# EAGLE design oresat-proto-card (EAGLE 9.3.0)

## Sheet 1 of 5: Connectors
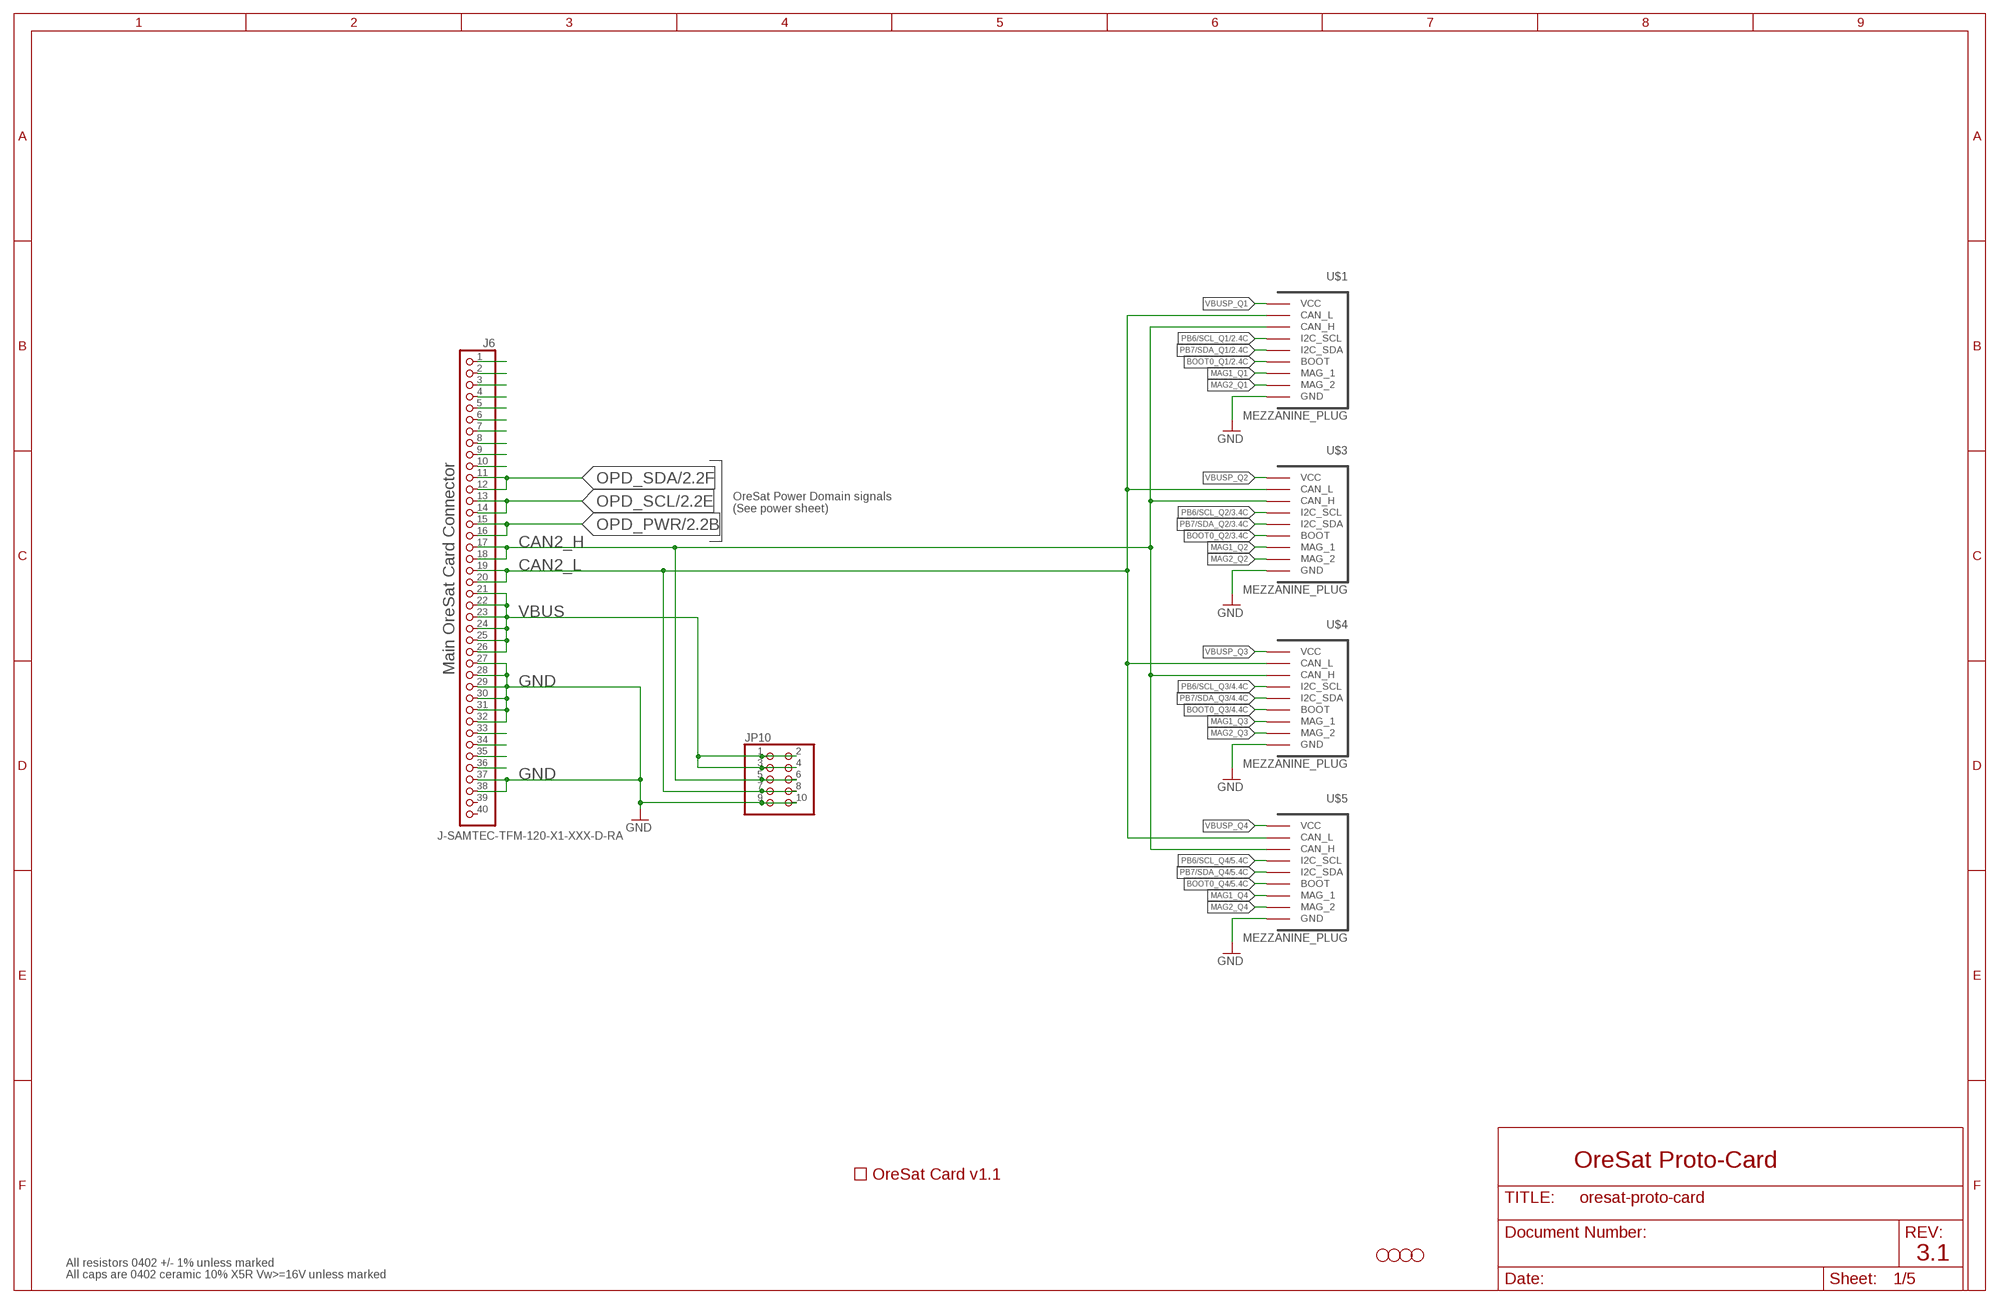
[diagram p0: schematic, sheet 1]

### Parts
H1  STAND-OFFTIGHT  [STAND-OFF-TIGHT]
H2  STAND-OFFTIGHT  [STAND-OFF-TIGHT]
H3  STAND-OFFTIGHT  [STAND-OFF-TIGHT]
H4  STAND-OFFTIGHT  [STAND-OFF-TIGHT]
J6  J-SAMTEC-TFM-120-X1-XXX-D-RA  [J-SAMTEC-TFM-120-X1-XXX-D-RA]
JP10  PINHD-2X5  [2X05]
U$1  MEZZANINE_PLUG  [MEZZANINE_PLUG]
U$2  ORESAT-CARD-V1.1-3XRF  [ORESAT-CARD-V1.1-3XRF]
U$3  MEZZANINE_PLUG  [MEZZANINE_PLUG]
U$4  MEZZANINE_PLUG  [MEZZANINE_PLUG]
U$5  MEZZANINE_PLUG  [MEZZANINE_PLUG]

### Nets
BOOT0_Q1: U$1.P$9(BOOT) U$1.P$22(BOOT) ; also sheet 2
BOOT0_Q2: U$3.P$9(BOOT) U$3.P$22(BOOT) ; also sheet 3
BOOT0_Q3: U$4.P$9(BOOT) U$4.P$22(BOOT) ; also sheet 4
BOOT0_Q4: U$5.P$9(BOOT) U$5.P$22(BOOT) ; also sheet 5
CAN2_H: J6.17 J6.18 JP10.5 JP10.6 U$1.P$6(CAN_H) U$1.P$25(CAN_H) U$3.P$6(CAN_H) U$3.P$25(CAN_H) U$4.P$6(CAN_H) U$4.P$25(CAN_H) U$5.P$6(CAN_H) U$5.P$25(CAN_H)
CAN2_L: J6.19 J6.20 JP10.7 JP10.8 U$1.P$5(CAN_L) U$1.P$26(CAN_L) U$3.P$5(CAN_L) U$3.P$26(CAN_L) U$4.P$5(CAN_L) U$4.P$26(CAN_L) U$5.P$5(CAN_L) U$5.P$26(CAN_L)
GND: J6.27 J6.28 J6.29 J6.30 J6.31 J6.32 J6.37 J6.38 JP10.9 JP10.10 U$1.P$1(GND) U$1.P$2(GND) U$1.P$14(GND) U$1.P$15(GND) U$1.P$16(GND) U$1.P$17(GND) U$1.P$29(GND) U$1.P$30(GND) U$3.P$1(GND) U$3.P$2(GND) U$3.P$14(GND) U$3.P$15(GND) U$3.P$16(GND) U$3.P$17(GND) U$3.P$29(GND) U$3.P$30(GND) U$4.P$1(GND) U$4.P$2(GND) U$4.P$14(GND) U$4.P$15(GND) U$4.P$16(GND) U$4.P$17(GND) U$4.P$29(GND) U$4.P$30(GND) U$5.P$1(GND) U$5.P$2(GND) U$5.P$14(GND) U$5.P$15(GND) U$5.P$16(GND) U$5.P$17(GND) U$5.P$29(GND) U$5.P$30(GND) ; also sheet 2,3,4,5
MAG1_Q1: U$1.P$10(MAG_1) U$1.P$21(MAG_1)
MAG1_Q2: U$3.P$10(MAG_1) U$3.P$21(MAG_1)
MAG1_Q3: U$4.P$10(MAG_1) U$4.P$21(MAG_1)
MAG1_Q4: U$5.P$10(MAG_1) U$5.P$21(MAG_1)
MAG2_Q1: U$1.P$11(MAG_2) U$1.P$20(MAG_2)
MAG2_Q2: U$3.P$11(MAG_2) U$3.P$20(MAG_2)
MAG2_Q3: U$4.P$11(MAG_2) U$4.P$20(MAG_2)
MAG2_Q4: U$5.P$11(MAG_2) U$5.P$20(MAG_2)
N$1: J6.34
N$271: J6.33
N$300: J6.2
N$400: J6.35
N$406: J6.36
N$479: J6.9
N$480: J6.4
N$482: J6.5
N$498: J6.1
N$499: J6.7
N$500: J6.6
N$503: J6.8
N$504: J6.10
OPD_PWR: J6.15 J6.16 ; also sheet 2,3,4,5
OPD_SCL: J6.13 J6.14 ; also sheet 2,3,4,5
OPD_SDA: J6.11 J6.12 ; also sheet 2,3,4,5
PB6/SCL_Q1: U$1.P$7(I2C_SCL) U$1.P$24(I2C_SCL) ; also sheet 2
PB6/SCL_Q2: U$3.P$7(I2C_SCL) U$3.P$24(I2C_SCL) ; also sheet 3
PB6/SCL_Q3: U$4.P$7(I2C_SCL) U$4.P$24(I2C_SCL) ; also sheet 4
PB6/SCL_Q4: U$5.P$7(I2C_SCL) U$5.P$24(I2C_SCL) ; also sheet 5
PB7/SDA_Q1: U$1.P$8(I2C_SDA) U$1.P$23(I2C_SDA) ; also sheet 2
PB7/SDA_Q2: U$3.P$8(I2C_SDA) U$3.P$23(I2C_SDA) ; also sheet 3
PB7/SDA_Q3: U$4.P$8(I2C_SDA) U$4.P$23(I2C_SDA) ; also sheet 4
PB7/SDA_Q4: U$5.P$8(I2C_SDA) U$5.P$23(I2C_SDA) ; also sheet 5
SPARE4: J6.3
VBUS: J6.21 J6.22 J6.23 J6.24 J6.25 J6.26 JP10.1 JP10.2 JP10.3 JP10.4 ; also sheet 2,3,4,5
VBUSP_Q1: U$1.P$3(VCC) U$1.P$4(VCC) U$1.P$12(VCC) U$1.P$13(VCC) U$1.P$18(VCC) U$1.P$19(VCC) U$1.P$27(VCC) U$1.P$28(VCC) ; also sheet 2
VBUSP_Q2: U$3.P$3(VCC) U$3.P$4(VCC) U$3.P$12(VCC) U$3.P$13(VCC) U$3.P$18(VCC) U$3.P$19(VCC) U$3.P$27(VCC) U$3.P$28(VCC) ; also sheet 3
VBUSP_Q3: U$4.P$3(VCC) U$4.P$4(VCC) U$4.P$12(VCC) U$4.P$13(VCC) U$4.P$18(VCC) U$4.P$19(VCC) U$4.P$27(VCC) U$4.P$28(VCC) ; also sheet 4
VBUSP_Q4: U$5.P$3(VCC) U$5.P$4(VCC) U$5.P$12(VCC) U$5.P$13(VCC) U$5.P$18(VCC) U$5.P$19(VCC) U$5.P$27(VCC) U$5.P$28(VCC) ; also sheet 5
Unconnected: J6.39 J6.40

### Notes on the sheet
- OreSat Power Domain signals
  (See power sheet)
- Main OreSat Card Connector
- OreSat Proto-Card
- 3.1
- All resistors 0402 +/- 1% unless marked
- All caps are 0402 ceramic 10% X5R Vw>=16V unless marked

## Sheet 2 of 5: Power Domaine Q1
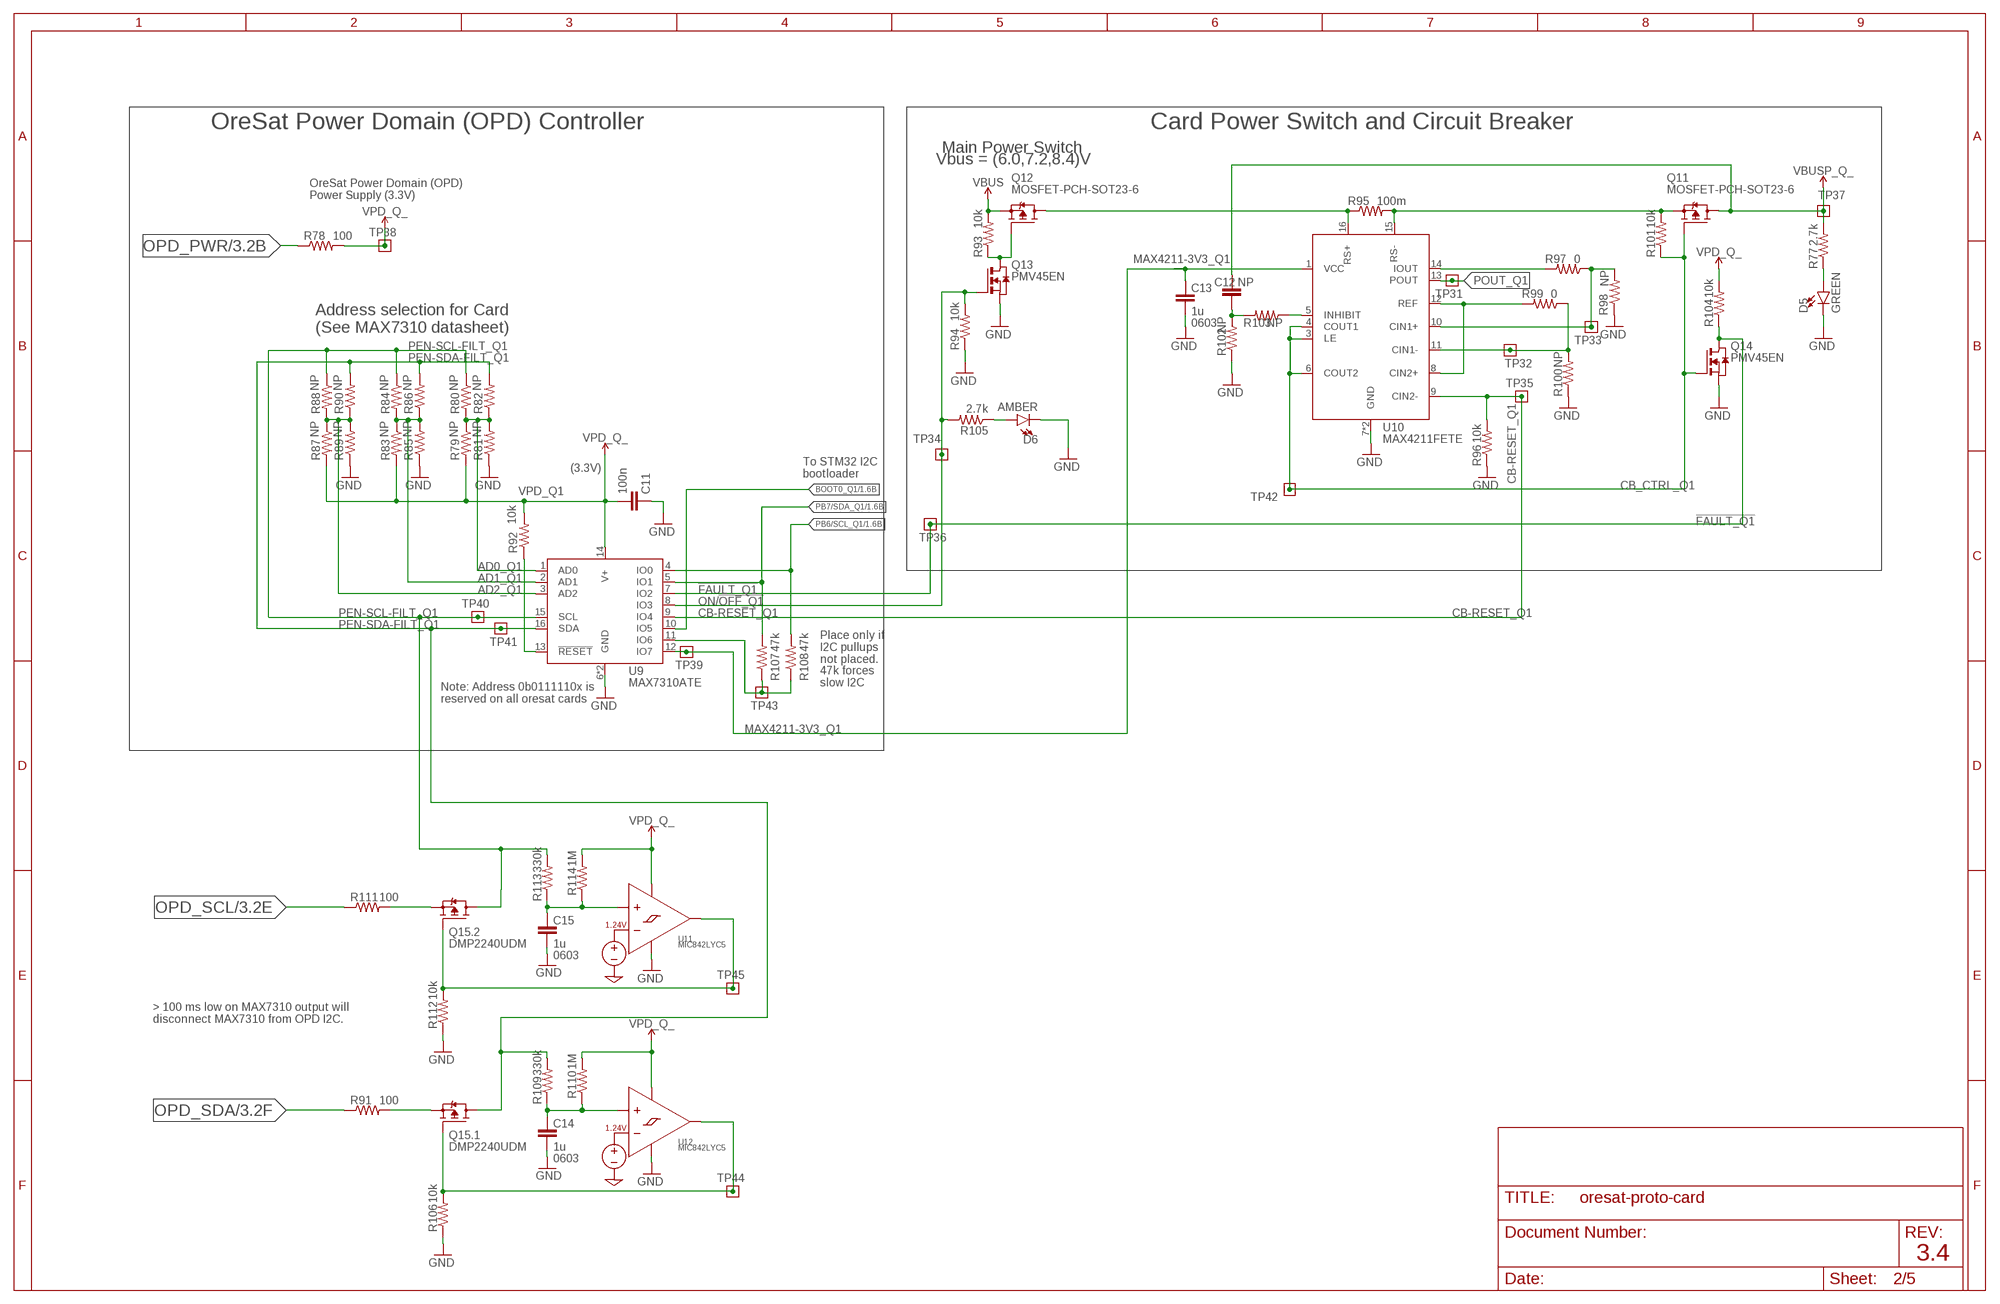
[diagram p1: schematic, sheet 2]

### Parts
C11  100n  C-EU0402-B-NOSILK  [.0402-B-NOSILK]
C12  NP  C-EU0402-B-NOSILK  [.0402-B-NOSILK]
C13  1u  C-EU0603-B-NOSILK  [.0603-B-NOSILK]
C14  1u  C-EU0603-B-NOSILK  [.0603-B-NOSILK]
C15  1u  C-EU0603-B-NOSILK  [.0603-B-NOSILK]
D5  GREEN  LED-GREEN0603  [LED-0603]
D6  AMBER  LED-GREEN0603  [LED-0603]
Q11  MOSFET-PCH-SOT23-6  [SOT23-6]
Q12  MOSFET-PCH-SOT23-6  [SOT23-6]
Q13  PMV45EN  [SOT23]
Q14  PMV45EN  [SOT23]
Q15  DMP2240UDM  MOSFET-PCH-SOT23-6  [SOT23-6]
R77  2.7k  R-US_0402-B-NOSILK  [.0402-B-NOSILK]
R78  100  R-US_0402-B-NOSILK  [.0402-B-NOSILK]
R79  NP  R-US_0402-B-NOSILK  [.0402-B-NOSILK]
R80  NP  R-US_0402-B-NOSILK  [.0402-B-NOSILK]
R81  NP  R-US_0402-B-NOSILK  [.0402-B-NOSILK]
R82  NP  R-US_0402-B-NOSILK  [.0402-B-NOSILK]
R83  NP  R-US_0402-B-NOSILK  [.0402-B-NOSILK]
R84  NP  R-US_0402-B-NOSILK  [.0402-B-NOSILK]
R85  NP  R-US_0402-B-NOSILK  [.0402-B-NOSILK]
R86  NP  R-US_0402-B-NOSILK  [.0402-B-NOSILK]
R87  NP  R-US_0402-B-NOSILK  [.0402-B-NOSILK]
R88  NP  R-US_0402-B-NOSILK  [.0402-B-NOSILK]
R89  NP  R-US_0402-B-NOSILK  [.0402-B-NOSILK]
R90  NP  R-US_0402-B-NOSILK  [.0402-B-NOSILK]
R91  100  R-US_0402-B-NOSILK  [.0402-B-NOSILK]
R92  10k  R-US_0402-B-NOSILK  [.0402-B-NOSILK]
R93  10k  R-US_0402-B-NOSILK  [.0402-B-NOSILK]
R94  10k  R-US_0402-B-NOSILK  [.0402-B-NOSILK]
R95  100m  R-US_R1206  [R1206]
R96  10k  R-US_0402-B-NOSILK  [.0402-B-NOSILK]
R97  0  R-US_0402-B-NOSILK  [.0402-B-NOSILK]
R98  NP  R-US_0402-B-NOSILK  [.0402-B-NOSILK]
R99  0  R-US_0402-B-NOSILK  [.0402-B-NOSILK]
R100  NP  R-US_0402-B-NOSILK  [.0402-B-NOSILK]
R101  10k  R-US_0402-B-NOSILK  [.0402-B-NOSILK]
R102  NP  R-US_0402-B-NOSILK  [.0402-B-NOSILK]
R103  NP  R-US_0402-B-NOSILK  [.0402-B-NOSILK]
R104  10k  R-US_0402-B-NOSILK  [.0402-B-NOSILK]
R105  2.7k  R-US_0402-B-NOSILK  [.0402-B-NOSILK]
R106  10k  R-US_0402-B-NOSILK  [.0402-B-NOSILK]
R107  47k  R-US_0402-B-NOSILK  [.0402-B-NOSILK]
R108  47k  R-US_0402-B-NOSILK  [.0402-B-NOSILK]
R109  330k  R-US_0402-B-NOSILK  [.0402-B-NOSILK]
R110  1M  R-US_0402-B-NOSILK  [.0402-B-NOSILK]
R111  100  R-US_0402-B-NOSILK  [.0402-B-NOSILK]
R112  10k  R-US_0402-B-NOSILK  [.0402-B-NOSILK]
R113  330k  R-US_0402-B-NOSILK  [.0402-B-NOSILK]
R114  1M  R-US_0402-B-NOSILK  [.0402-B-NOSILK]
TP31  TEST-POINT  [2MM-TEST-POINT]
TP32  TEST-POINT  [2MM-TEST-POINT]
TP33  TEST-POINT  [2MM-TEST-POINT]
TP34  TEST-POINT  [2MM-TEST-POINT]
TP35  TEST-POINT  [2MM-TEST-POINT]
TP36  TEST-POINT  [2MM-TEST-POINT]
TP37  TEST-POINT  [2MM-TEST-POINT]
TP38  TEST-POINT  [2MM-TEST-POINT]
TP39  TEST-POINT  [2MM-TEST-POINT]
TP40  TEST-POINT  [2MM-TEST-POINT]
TP41  TEST-POINT  [2MM-TEST-POINT]
TP42  TEST-POINT  [2MM-TEST-POINT]
TP43  TEST-POINT  [2MM-TEST-POINT]
TP44  TEST-POINT  [2MM-TEST-POINT]
TP45  TEST-POINT  [2MM-TEST-POINT]
U9  MAX7310ATE  MAX7310  [QFN65P400X400X80-17T210]
U10  MAX4211FETE  MAX4211  [QFN65P400X400X80-17T210]
U11  MIC842LYC5  [SC70-5]
U12  MIC842LYC5  [SC70-5]

### Nets
!FAULT_Q1: Q14.3(D) R104.1 TP36.1 U9.7(IO2)
AD0_Q1: R79.1 R80.2 R81.2 R82.1 U9.1(AD0)
AD1_Q1: R83.1 R84.2 R85.2 R86.1 U9.2(AD1)
AD2_Q1: R87.1 R88.2 R89.2 R90.1 U9.3(AD2)
BOOT0_Q1: U9.10(IO5) ; also sheet 1
CB-RESET_Q1: R96.2 TP35.1 U9.9(IO4) U10.9(CIN2-)
CB_CTRL_Q1: Q11.3(G) Q14.1(G) R101.1 TP42.1 U10.3(LE) U10.4(COUT1) U10.6(COUT2)
GND: C11.1 C13.2 C14.2 C15.2 D5.C D6.C Q13.2(S) Q14.2(S) R81.1 R85.1 R89.1 R94.1 R96.1 R98.1 R100.1 R102.1 R106.1 R112.1 U9.6(GND) U9.EPAD(GND) U10.7(GND) U10.EPAD(GND) U11.2(GND) U12.2(GND) ; also sheet 1,3,4,5
IOUT_Q1: R97.2 U10.14(IOUT)
MAX4211-3V3_Q1: C13.1 TP39.1 U9.12(IO7) U10.1(VCC)
N$169: D5.A R77.1
N$170: R92.1 U9.13(!RESET)
N$171: Q12.3(G) Q13.3(D) R93.1
N$172: Q12.1(D) Q12.2(D) Q12.5(D) Q12.6(D) R95.1 U10.16(RS+)
N$173: R97.1 R98.2 TP33.1 U10.10(CIN1+)
N$174: R99.1 R100.2 TP32.1 U10.11(CIN1-)
N$175: R99.2 U10.8(CIN2+) U10.12(REF)
N$176: R103.1 U10.5(INHIBIT)
N$177: C12.1 R102.2 R103.2
N$178: Q11.4(S) R95.2 R101.2 U10.15(RS-)
N$179: D6.A R105.1
N$180: Q15.5(.1:S) R91.2
N$181: Q15.1(.1:G) R106.2 TP44.1 U12.4(OUT)
N$182: R107.1 R108.1 TP43.1 U9.11(IO6)
N$183: Q15.2(.2:S) R111.2
N$184: Q15.3(.2:G) R112.2 TP45.1 U11.4(OUT)
N$185: C15.1 R113.1 R114.1 U11.1(INP)
N$186: C14.1 R109.1 R110.1 U12.1(INP)
ON/!OFF_Q1: Q13.1(G) R94.2 R105.2 TP34.1 U9.8(IO3)
OPD_PWR: R78.1 ; also sheet 1,3,4,5
OPD_SCL: R111.1 ; also sheet 1,3,4,5
OPD_SDA: R91.1 ; also sheet 1,3,4,5
PB6/SCL_Q1: R108.2 U9.4(IO0) ; also sheet 1
PB7/SDA_Q1: R107.2 U9.5(IO1) ; also sheet 1
PEN-SCL-FILT_Q1: Q15.4(.2:D) R80.1 R84.1 R88.1 R113.2 TP40.1 U9.15(SCL)
PEN-SDA-FILT_Q1: Q15.6(.1:D) R82.2 R86.2 R90.2 R109.2 TP41.1 U9.16(SDA)
POUT_Q1: TP31.1 U10.13(POUT)
VBUS: Q12.4(S) R93.2 ; also sheet 1,3,4,5
VBUSP_Q1: C12.2 Q11.1(D) Q11.2(D) Q11.5(D) Q11.6(D) R77.2 TP37.1 ; supply symbol labelled VBUSP_Q_ ; also sheet 1
VPD_Q1: C11.2 R78.2 R79.2 R83.2 R87.2 R92.2 R104.2 R110.2 R114.2 TP38.1 U9.14(V+) U11.5(VDD) U12.5(VDD) ; supply symbol labelled VPD_Q_

### Notes on the sheet
- OreSat Power Domain (OPD) Controller | Card Power Switch and Circuit Breaker
- Main Power Switch
- Vbus = (6.0,7.2,8.4)V
- OreSat Power Domain (OPD)
  Power Supply (3.3V)
- 0603
- Address selection for Card
  (See MAX7310 datasheet)
- (3.3V)
- To STM32 I2C
  bootloader
- Place only if
  I2C pullups
  not placed.
- 47k forces
  slow I2C
- Note: Address 0b0111110x is 
  reserved on all oresat cards
- 0603
- > 100 ms low on MAX7310 output will
  disconnect MAX7310 from OPD I2C.
- 0603
- 3.4

## Sheet 3 of 5: Power Domaine Q2
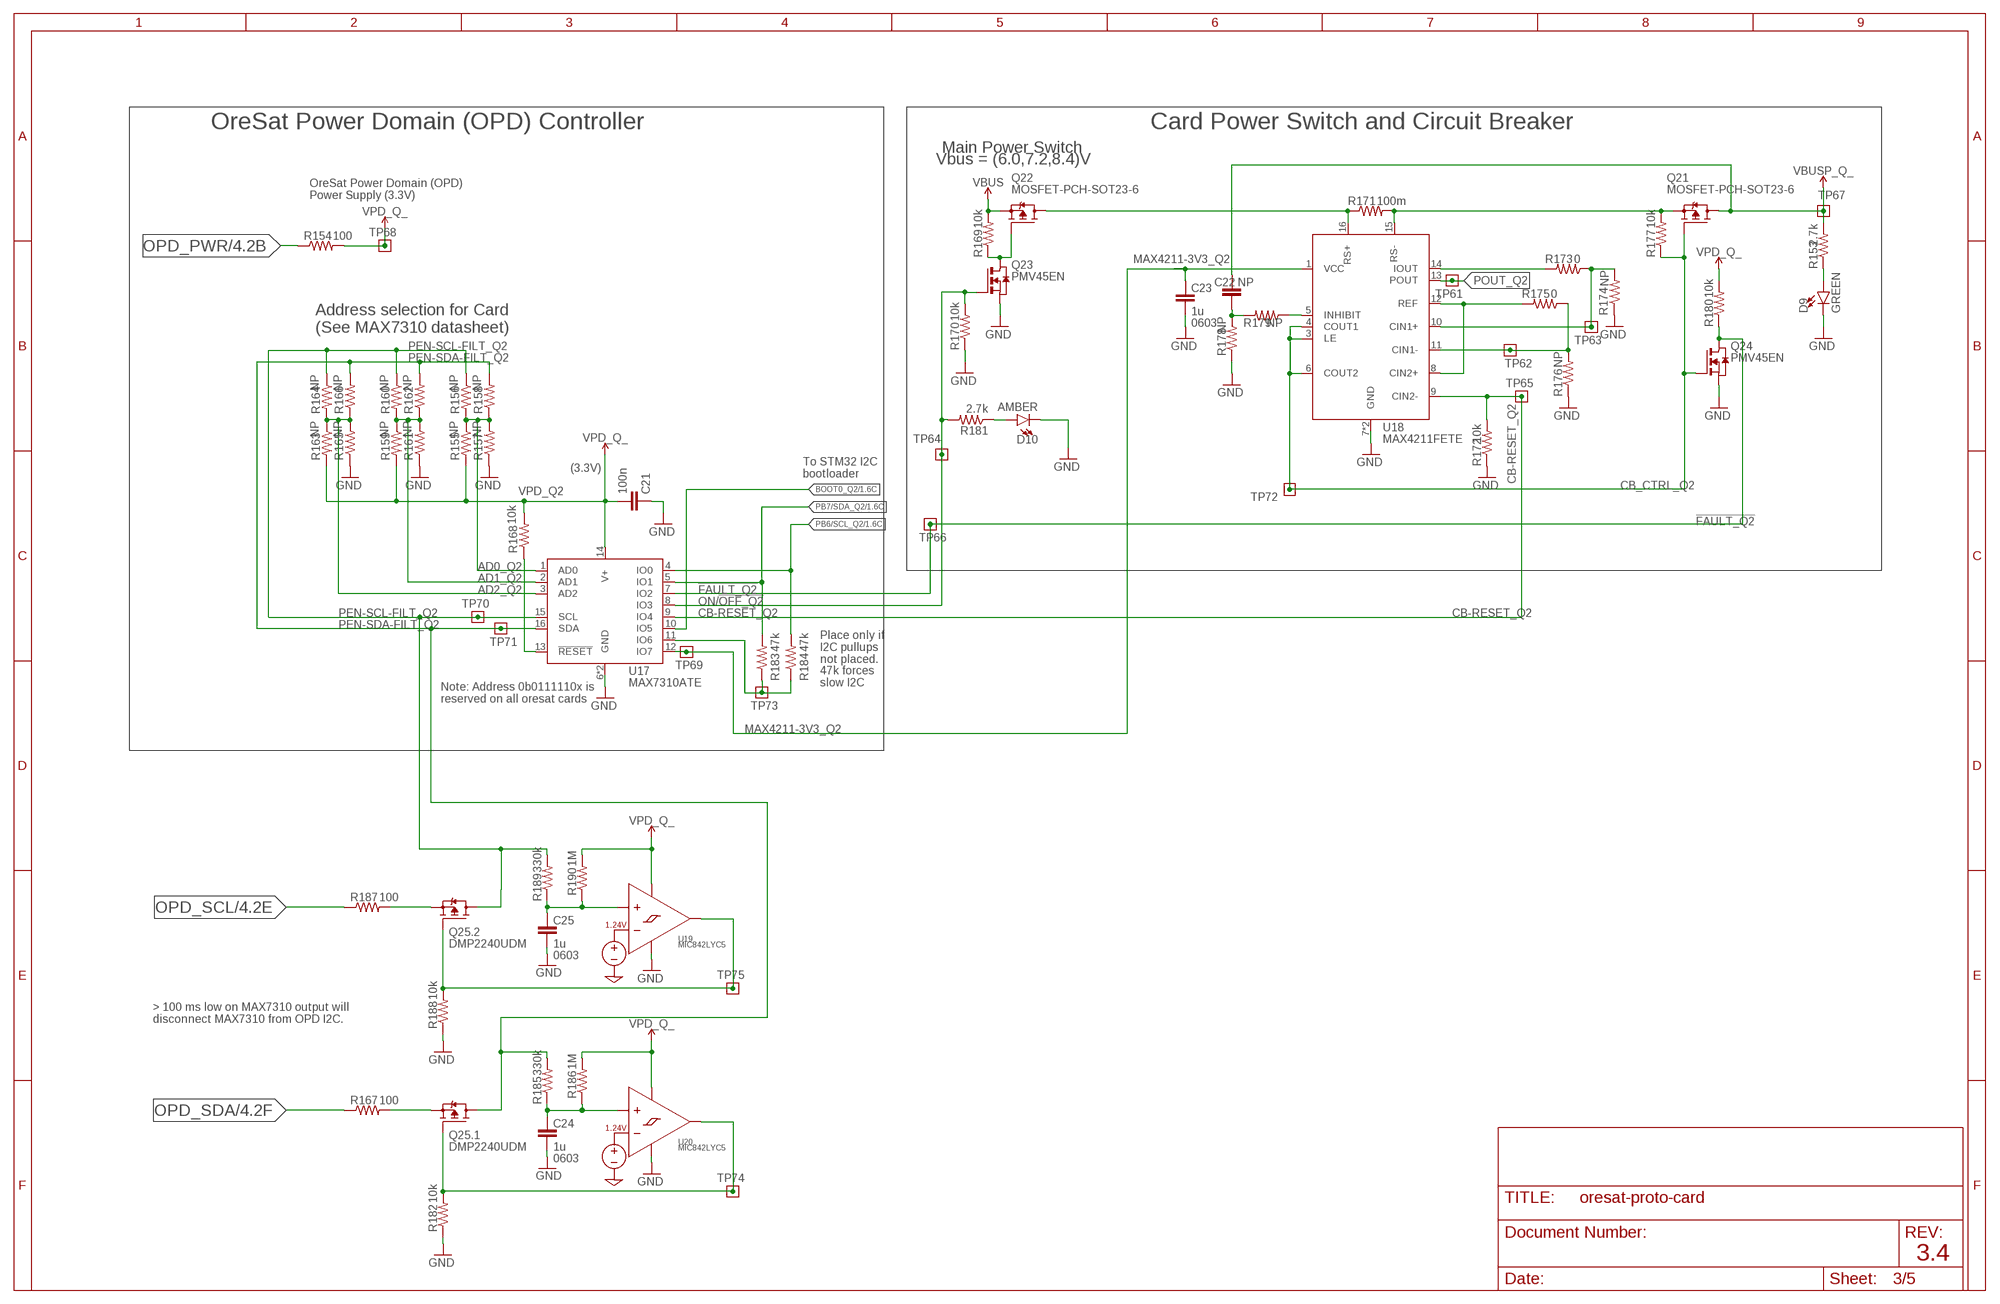
[diagram p2: schematic, sheet 3]

### Parts
C21  100n  C-EU0402-B-NOSILK  [.0402-B-NOSILK]
C22  NP  C-EU0402-B-NOSILK  [.0402-B-NOSILK]
C23  1u  C-EU0603-B-NOSILK  [.0603-B-NOSILK]
C24  1u  C-EU0603-B-NOSILK  [.0603-B-NOSILK]
C25  1u  C-EU0603-B-NOSILK  [.0603-B-NOSILK]
D9  GREEN  LED-GREEN0603  [LED-0603]
D10  AMBER  LED-GREEN0603  [LED-0603]
Q21  MOSFET-PCH-SOT23-6  [SOT23-6]
Q22  MOSFET-PCH-SOT23-6  [SOT23-6]
Q23  PMV45EN  [SOT23]
Q24  PMV45EN  [SOT23]
Q25  DMP2240UDM  MOSFET-PCH-SOT23-6  [SOT23-6]
R153  2.7k  R-US_0402-B-NOSILK  [.0402-B-NOSILK]
R154  100  R-US_0402-B-NOSILK  [.0402-B-NOSILK]
R155  NP  R-US_0402-B-NOSILK  [.0402-B-NOSILK]
R156  NP  R-US_0402-B-NOSILK  [.0402-B-NOSILK]
R157  NP  R-US_0402-B-NOSILK  [.0402-B-NOSILK]
R158  NP  R-US_0402-B-NOSILK  [.0402-B-NOSILK]
R159  NP  R-US_0402-B-NOSILK  [.0402-B-NOSILK]
R160  NP  R-US_0402-B-NOSILK  [.0402-B-NOSILK]
R161  NP  R-US_0402-B-NOSILK  [.0402-B-NOSILK]
R162  NP  R-US_0402-B-NOSILK  [.0402-B-NOSILK]
R163  NP  R-US_0402-B-NOSILK  [.0402-B-NOSILK]
R164  NP  R-US_0402-B-NOSILK  [.0402-B-NOSILK]
R165  NP  R-US_0402-B-NOSILK  [.0402-B-NOSILK]
R166  NP  R-US_0402-B-NOSILK  [.0402-B-NOSILK]
R167  100  R-US_0402-B-NOSILK  [.0402-B-NOSILK]
R168  10k  R-US_0402-B-NOSILK  [.0402-B-NOSILK]
R169  10k  R-US_0402-B-NOSILK  [.0402-B-NOSILK]
R170  10k  R-US_0402-B-NOSILK  [.0402-B-NOSILK]
R171  100m  R-US_R1206  [R1206]
R172  10k  R-US_0402-B-NOSILK  [.0402-B-NOSILK]
R173  0  R-US_0402-B-NOSILK  [.0402-B-NOSILK]
R174  NP  R-US_0402-B-NOSILK  [.0402-B-NOSILK]
R175  0  R-US_0402-B-NOSILK  [.0402-B-NOSILK]
R176  NP  R-US_0402-B-NOSILK  [.0402-B-NOSILK]
R177  10k  R-US_0402-B-NOSILK  [.0402-B-NOSILK]
R178  NP  R-US_0402-B-NOSILK  [.0402-B-NOSILK]
R179  NP  R-US_0402-B-NOSILK  [.0402-B-NOSILK]
R180  10k  R-US_0402-B-NOSILK  [.0402-B-NOSILK]
R181  2.7k  R-US_0402-B-NOSILK  [.0402-B-NOSILK]
R182  10k  R-US_0402-B-NOSILK  [.0402-B-NOSILK]
R183  47k  R-US_0402-B-NOSILK  [.0402-B-NOSILK]
R184  47k  R-US_0402-B-NOSILK  [.0402-B-NOSILK]
R185  330k  R-US_0402-B-NOSILK  [.0402-B-NOSILK]
R186  1M  R-US_0402-B-NOSILK  [.0402-B-NOSILK]
R187  100  R-US_0402-B-NOSILK  [.0402-B-NOSILK]
R188  10k  R-US_0402-B-NOSILK  [.0402-B-NOSILK]
R189  330k  R-US_0402-B-NOSILK  [.0402-B-NOSILK]
R190  1M  R-US_0402-B-NOSILK  [.0402-B-NOSILK]
TP61  TEST-POINT  [2MM-TEST-POINT]
TP62  TEST-POINT  [2MM-TEST-POINT]
TP63  TEST-POINT  [2MM-TEST-POINT]
TP64  TEST-POINT  [2MM-TEST-POINT]
TP65  TEST-POINT  [2MM-TEST-POINT]
TP66  TEST-POINT  [2MM-TEST-POINT]
TP67  TEST-POINT  [2MM-TEST-POINT]
TP68  TEST-POINT  [2MM-TEST-POINT]
TP69  TEST-POINT  [2MM-TEST-POINT]
TP70  TEST-POINT  [2MM-TEST-POINT]
TP71  TEST-POINT  [2MM-TEST-POINT]
TP72  TEST-POINT  [2MM-TEST-POINT]
TP73  TEST-POINT  [2MM-TEST-POINT]
TP74  TEST-POINT  [2MM-TEST-POINT]
TP75  TEST-POINT  [2MM-TEST-POINT]
U17  MAX7310ATE  MAX7310  [QFN65P400X400X80-17T210]
U18  MAX4211FETE  MAX4211  [QFN65P400X400X80-17T210]
U19  MIC842LYC5  [SC70-5]
U20  MIC842LYC5  [SC70-5]

### Nets
!FAULT_Q2: Q24.3(D) R180.1 TP66.1 U17.7(IO2)
AD0_Q2: R155.1 R156.2 R157.2 R158.1 U17.1(AD0)
AD1_Q2: R159.1 R160.2 R161.2 R162.1 U17.2(AD1)
AD2_Q2: R163.1 R164.2 R165.2 R166.1 U17.3(AD2)
BOOT0_Q2: U17.10(IO5) ; also sheet 1
CB-RESET_Q2: R172.2 TP65.1 U17.9(IO4) U18.9(CIN2-)
CB_CTRL_Q2: Q21.3(G) Q24.1(G) R177.1 TP72.1 U18.3(LE) U18.4(COUT1) U18.6(COUT2)
GND: C21.1 C23.2 C24.2 C25.2 D9.C D10.C Q23.2(S) Q24.2(S) R157.1 R161.1 R165.1 R170.1 R172.1 R174.1 R176.1 R178.1 R182.1 R188.1 U17.6(GND) U17.EPAD(GND) U18.7(GND) U18.EPAD(GND) U19.2(GND) U20.2(GND) ; also sheet 1,2,4,5
IOUT_Q2: R173.2 U18.14(IOUT)
MAX4211-3V3_Q2: C23.1 TP69.1 U17.12(IO7) U18.1(VCC)
N$205: D9.A R153.1
N$206: R168.1 U17.13(!RESET)
N$207: Q22.3(G) Q23.3(D) R169.1
N$208: Q22.1(D) Q22.2(D) Q22.5(D) Q22.6(D) R171.1 U18.16(RS+)
N$209: R173.1 R174.2 TP63.1 U18.10(CIN1+)
N$210: R175.1 R176.2 TP62.1 U18.11(CIN1-)
N$211: R175.2 U18.8(CIN2+) U18.12(REF)
N$212: R179.1 U18.5(INHIBIT)
N$213: C22.1 R178.2 R179.2
N$214: Q21.4(S) R171.2 R177.2 U18.15(RS-)
N$215: D10.A R181.1
N$216: Q25.5(.1:S) R167.2
N$217: Q25.1(.1:G) R182.2 TP74.1 U20.4(OUT)
N$218: R183.1 R184.1 TP73.1 U17.11(IO6)
N$219: Q25.2(.2:S) R187.2
N$220: Q25.3(.2:G) R188.2 TP75.1 U19.4(OUT)
N$221: C25.1 R189.1 R190.1 U19.1(INP)
N$222: C24.1 R185.1 R186.1 U20.1(INP)
ON/!OFF_Q2: Q23.1(G) R170.2 R181.2 TP64.1 U17.8(IO3)
OPD_PWR: R154.1 ; also sheet 1,2,4,5
OPD_SCL: R187.1 ; also sheet 1,2,4,5
OPD_SDA: R167.1 ; also sheet 1,2,4,5
PB6/SCL_Q2: R184.2 U17.4(IO0) ; also sheet 1
PB7/SDA_Q2: R183.2 U17.5(IO1) ; also sheet 1
PEN-SCL-FILT_Q2: Q25.4(.2:D) R156.1 R160.1 R164.1 R189.2 TP70.1 U17.15(SCL)
PEN-SDA-FILT_Q2: Q25.6(.1:D) R158.2 R162.2 R166.2 R185.2 TP71.1 U17.16(SDA)
POUT_Q2: TP61.1 U18.13(POUT)
VBUS: Q22.4(S) R169.2 ; also sheet 1,2,4,5
VBUSP_Q2: C22.2 Q21.1(D) Q21.2(D) Q21.5(D) Q21.6(D) R153.2 TP67.1 ; supply symbol labelled VBUSP_Q_ ; also sheet 1
VPD_Q2: C21.2 R154.2 R155.2 R159.2 R163.2 R168.2 R180.2 R186.2 R190.2 TP68.1 U17.14(V+) U19.5(VDD) U20.5(VDD) ; supply symbol labelled VPD_Q_

### Notes on the sheet
- OreSat Power Domain (OPD) Controller | Card Power Switch and Circuit Breaker
- Main Power Switch
- Vbus = (6.0,7.2,8.4)V
- OreSat Power Domain (OPD)
  Power Supply (3.3V)
- 0603
- Address selection for Card
  (See MAX7310 datasheet)
- (3.3V)
- To STM32 I2C
  bootloader
- Place only if
  I2C pullups
  not placed.
- 47k forces
  slow I2C
- Note: Address 0b0111110x is 
  reserved on all oresat cards
- 0603
- > 100 ms low on MAX7310 output will
  disconnect MAX7310 from OPD I2C.
- 0603
- 3.4

## Sheet 4 of 5: Power Domaine Q3
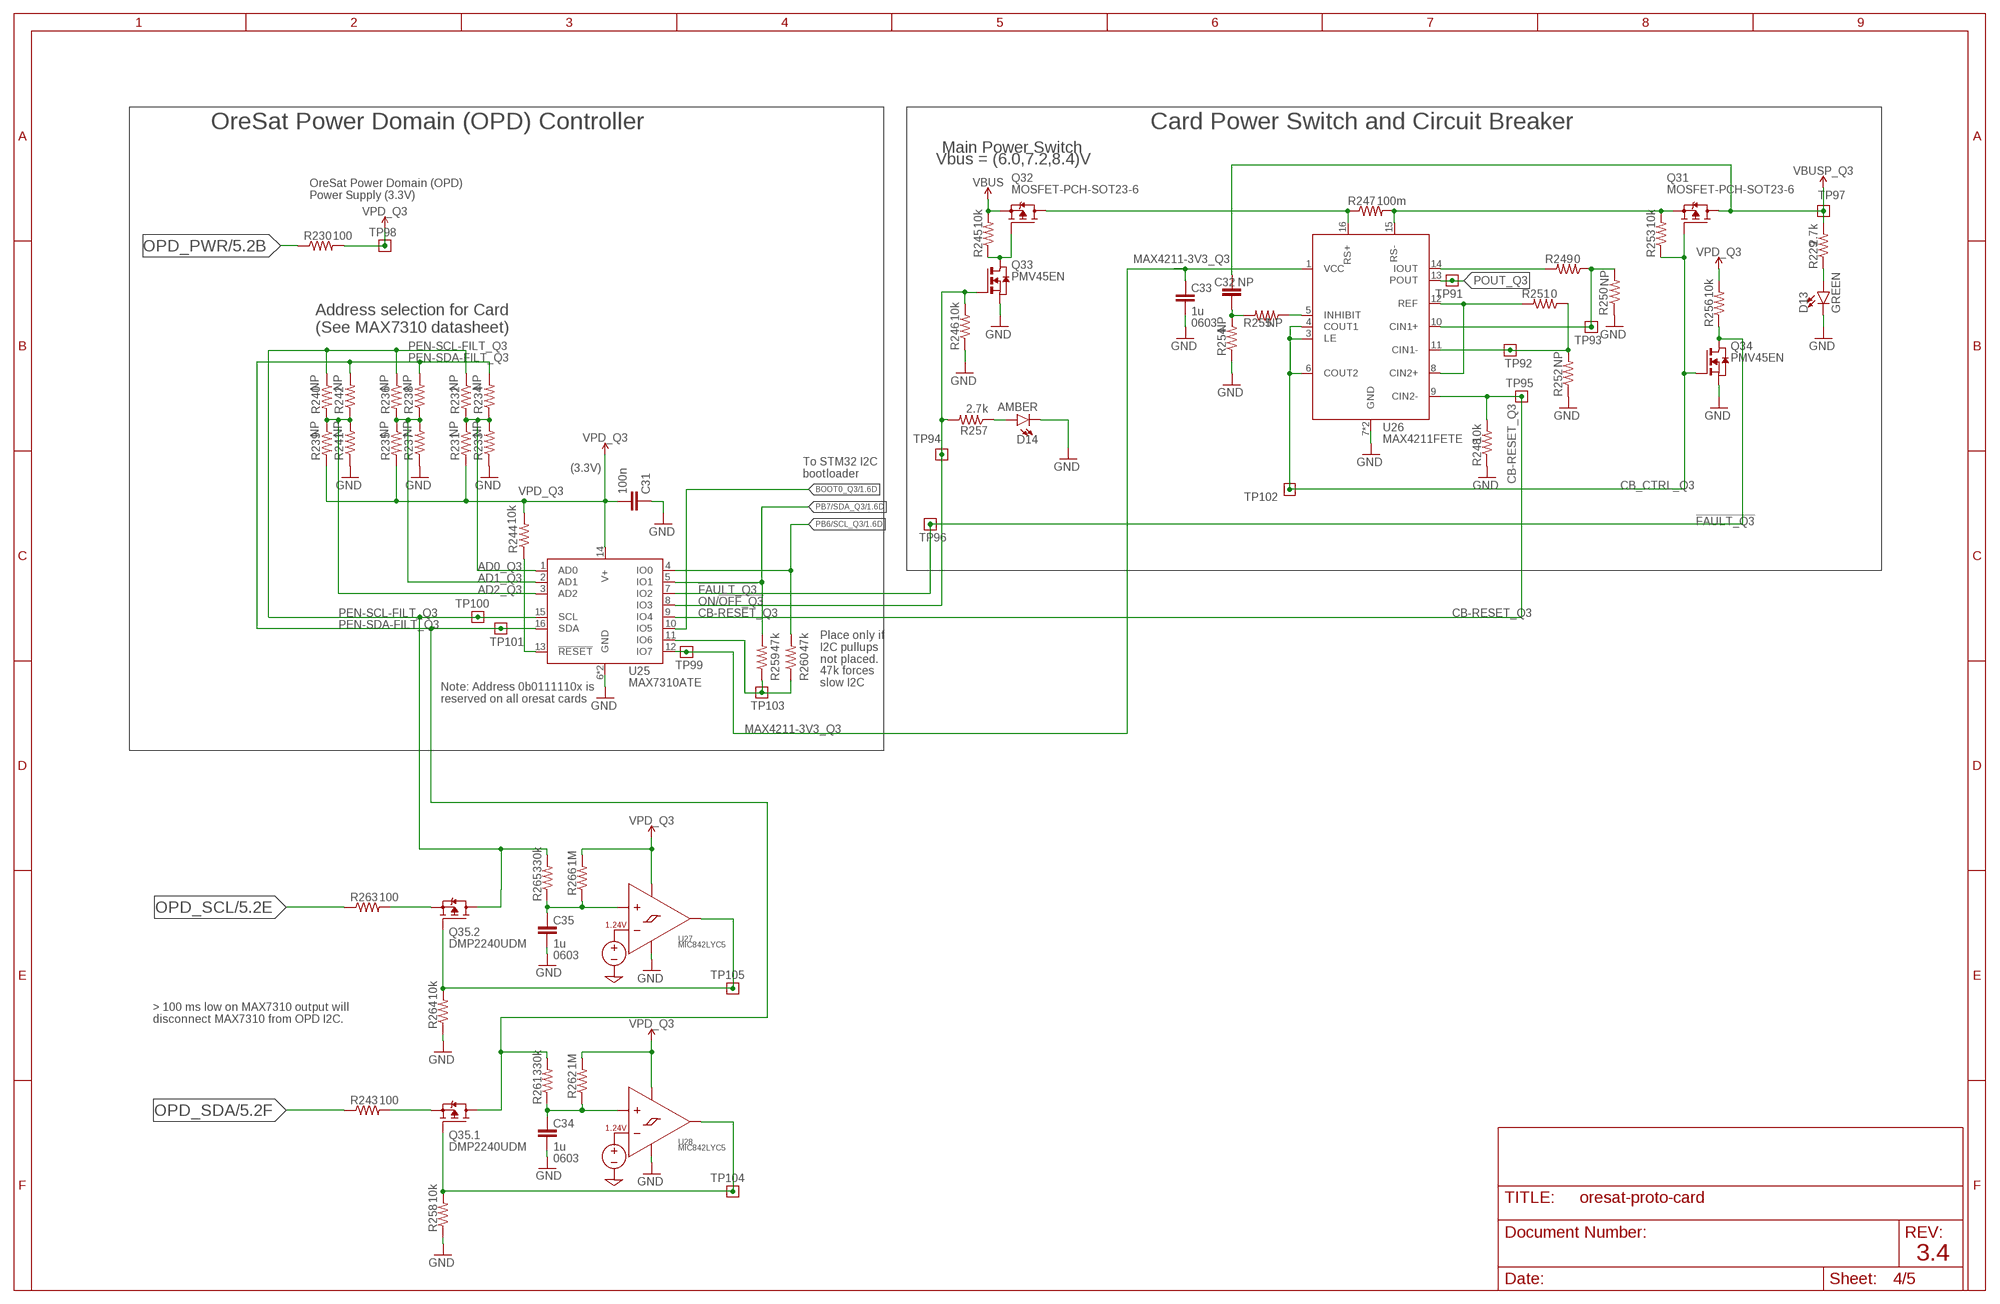
[diagram p3: schematic, sheet 4]

### Parts
C31  100n  C-EU0402-B-NOSILK  [.0402-B-NOSILK]
C32  NP  C-EU0402-B-NOSILK  [.0402-B-NOSILK]
C33  1u  C-EU0603-B-NOSILK  [.0603-B-NOSILK]
C34  1u  C-EU0603-B-NOSILK  [.0603-B-NOSILK]
C35  1u  C-EU0603-B-NOSILK  [.0603-B-NOSILK]
D13  GREEN  LED-GREEN0603  [LED-0603]
D14  AMBER  LED-GREEN0603  [LED-0603]
Q31  MOSFET-PCH-SOT23-6  [SOT23-6]
Q32  MOSFET-PCH-SOT23-6  [SOT23-6]
Q33  PMV45EN  [SOT23]
Q34  PMV45EN  [SOT23]
Q35  DMP2240UDM  MOSFET-PCH-SOT23-6  [SOT23-6]
R229  2.7k  R-US_0402-B-NOSILK  [.0402-B-NOSILK]
R230  100  R-US_0402-B-NOSILK  [.0402-B-NOSILK]
R231  NP  R-US_0402-B-NOSILK  [.0402-B-NOSILK]
R232  NP  R-US_0402-B-NOSILK  [.0402-B-NOSILK]
R233  NP  R-US_0402-B-NOSILK  [.0402-B-NOSILK]
R234  NP  R-US_0402-B-NOSILK  [.0402-B-NOSILK]
R235  NP  R-US_0402-B-NOSILK  [.0402-B-NOSILK]
R236  NP  R-US_0402-B-NOSILK  [.0402-B-NOSILK]
R237  NP  R-US_0402-B-NOSILK  [.0402-B-NOSILK]
R238  NP  R-US_0402-B-NOSILK  [.0402-B-NOSILK]
R239  NP  R-US_0402-B-NOSILK  [.0402-B-NOSILK]
R240  NP  R-US_0402-B-NOSILK  [.0402-B-NOSILK]
R241  NP  R-US_0402-B-NOSILK  [.0402-B-NOSILK]
R242  NP  R-US_0402-B-NOSILK  [.0402-B-NOSILK]
R243  100  R-US_0402-B-NOSILK  [.0402-B-NOSILK]
R244  10k  R-US_0402-B-NOSILK  [.0402-B-NOSILK]
R245  10k  R-US_0402-B-NOSILK  [.0402-B-NOSILK]
R246  10k  R-US_0402-B-NOSILK  [.0402-B-NOSILK]
R247  100m  R-US_R1206  [R1206]
R248  10k  R-US_0402-B-NOSILK  [.0402-B-NOSILK]
R249  0  R-US_0402-B-NOSILK  [.0402-B-NOSILK]
R250  NP  R-US_0402-B-NOSILK  [.0402-B-NOSILK]
R251  0  R-US_0402-B-NOSILK  [.0402-B-NOSILK]
R252  NP  R-US_0402-B-NOSILK  [.0402-B-NOSILK]
R253  10k  R-US_0402-B-NOSILK  [.0402-B-NOSILK]
R254  NP  R-US_0402-B-NOSILK  [.0402-B-NOSILK]
R255  NP  R-US_0402-B-NOSILK  [.0402-B-NOSILK]
R256  10k  R-US_0402-B-NOSILK  [.0402-B-NOSILK]
R257  2.7k  R-US_0402-B-NOSILK  [.0402-B-NOSILK]
R258  10k  R-US_0402-B-NOSILK  [.0402-B-NOSILK]
R259  47k  R-US_0402-B-NOSILK  [.0402-B-NOSILK]
R260  47k  R-US_0402-B-NOSILK  [.0402-B-NOSILK]
R261  330k  R-US_0402-B-NOSILK  [.0402-B-NOSILK]
R262  1M  R-US_0402-B-NOSILK  [.0402-B-NOSILK]
R263  100  R-US_0402-B-NOSILK  [.0402-B-NOSILK]
R264  10k  R-US_0402-B-NOSILK  [.0402-B-NOSILK]
R265  330k  R-US_0402-B-NOSILK  [.0402-B-NOSILK]
R266  1M  R-US_0402-B-NOSILK  [.0402-B-NOSILK]
TP91  TEST-POINT  [2MM-TEST-POINT]
TP92  TEST-POINT  [2MM-TEST-POINT]
TP93  TEST-POINT  [2MM-TEST-POINT]
TP94  TEST-POINT  [2MM-TEST-POINT]
TP95  TEST-POINT  [2MM-TEST-POINT]
TP96  TEST-POINT  [2MM-TEST-POINT]
TP97  TEST-POINT  [2MM-TEST-POINT]
TP98  TEST-POINT  [2MM-TEST-POINT]
TP99  TEST-POINT  [2MM-TEST-POINT]
TP100  TEST-POINT  [2MM-TEST-POINT]
TP101  TEST-POINT  [2MM-TEST-POINT]
TP102  TEST-POINT  [2MM-TEST-POINT]
TP103  TEST-POINT  [2MM-TEST-POINT]
TP104  TEST-POINT  [2MM-TEST-POINT]
TP105  TEST-POINT  [2MM-TEST-POINT]
U25  MAX7310ATE  MAX7310  [QFN65P400X400X80-17T210]
U26  MAX4211FETE  MAX4211  [QFN65P400X400X80-17T210]
U27  MIC842LYC5  [SC70-5]
U28  MIC842LYC5  [SC70-5]

### Nets
!FAULT_Q3: Q34.3(D) R256.1 TP96.1 U25.7(IO2)
AD0_Q3: R231.1 R232.2 R233.2 R234.1 U25.1(AD0)
AD1_Q3: R235.1 R236.2 R237.2 R238.1 U25.2(AD1)
AD2_Q3: R239.1 R240.2 R241.2 R242.1 U25.3(AD2)
BOOT0_Q3: U25.10(IO5) ; also sheet 1
CB-RESET_Q3: R248.2 TP95.1 U25.9(IO4) U26.9(CIN2-)
CB_CTRL_Q3: Q31.3(G) Q34.1(G) R253.1 TP102.1 U26.3(LE) U26.4(COUT1) U26.6(COUT2)
GND: C31.1 C33.2 C34.2 C35.2 D13.C D14.C Q33.2(S) Q34.2(S) R233.1 R237.1 R241.1 R246.1 R248.1 R250.1 R252.1 R254.1 R258.1 R264.1 U25.6(GND) U25.EPAD(GND) U26.7(GND) U26.EPAD(GND) U27.2(GND) U28.2(GND) ; also sheet 1,2,3,5
IOUT_Q_3: R249.2 U26.14(IOUT)
MAX4211-3V3_Q3: C33.1 TP99.1 U25.12(IO7) U26.1(VCC)
N$241: D13.A R229.1
N$242: R244.1 U25.13(!RESET)
N$243: Q32.3(G) Q33.3(D) R245.1
N$244: Q32.1(D) Q32.2(D) Q32.5(D) Q32.6(D) R247.1 U26.16(RS+)
N$245: R249.1 R250.2 TP93.1 U26.10(CIN1+)
N$246: R251.1 R252.2 TP92.1 U26.11(CIN1-)
N$247: R251.2 U26.8(CIN2+) U26.12(REF)
N$248: R255.1 U26.5(INHIBIT)
N$249: C32.1 R254.2 R255.2
N$250: Q31.4(S) R247.2 R253.2 U26.15(RS-)
N$251: D14.A R257.1
N$252: Q35.5(.1:S) R243.2
N$253: Q35.1(.1:G) R258.2 TP104.1 U28.4(OUT)
N$254: R259.1 R260.1 TP103.1 U25.11(IO6)
N$255: Q35.2(.2:S) R263.2
N$256: Q35.3(.2:G) R264.2 TP105.1 U27.4(OUT)
N$257: C35.1 R265.1 R266.1 U27.1(INP)
N$258: C34.1 R261.1 R262.1 U28.1(INP)
ON/!OFF_Q3: Q33.1(G) R246.2 R257.2 TP94.1 U25.8(IO3)
OPD_PWR: R230.1 ; also sheet 1,2,3,5
OPD_SCL: R263.1 ; also sheet 1,2,3,5
OPD_SDA: R243.1 ; also sheet 1,2,3,5
PB6/SCL_Q3: R260.2 U25.4(IO0) ; also sheet 1
PB7/SDA_Q3: R259.2 U25.5(IO1) ; also sheet 1
PEN-SCL-FILT_Q3: Q35.4(.2:D) R232.1 R236.1 R240.1 R265.2 TP100.1 U25.15(SCL)
PEN-SDA-FILT_Q3: Q35.6(.1:D) R234.2 R238.2 R242.2 R261.2 TP101.1 U25.16(SDA)
POUT_Q3: TP91.1 U26.13(POUT)
VBUS: Q32.4(S) R245.2 ; also sheet 1,2,3,5
VBUSP_Q3: C32.2 Q31.1(D) Q31.2(D) Q31.5(D) Q31.6(D) R229.2 TP97.1 ; also sheet 1
VPD_Q3: C31.2 R230.2 R231.2 R235.2 R239.2 R244.2 R256.2 R262.2 R266.2 TP98.1 U25.14(V+) U27.5(VDD) U28.5(VDD)

### Notes on the sheet
- OreSat Power Domain (OPD) Controller | Card Power Switch and Circuit Breaker
- Main Power Switch
- Vbus = (6.0,7.2,8.4)V
- OreSat Power Domain (OPD)
  Power Supply (3.3V)
- 0603
- Address selection for Card
  (See MAX7310 datasheet)
- (3.3V)
- To STM32 I2C
  bootloader
- Place only if
  I2C pullups
  not placed.
- 47k forces
  slow I2C
- Note: Address 0b0111110x is 
  reserved on all oresat cards
- 0603
- > 100 ms low on MAX7310 output will
  disconnect MAX7310 from OPD I2C.
- 0603
- 3.4

## Sheet 5 of 5: Power Domaine Q4
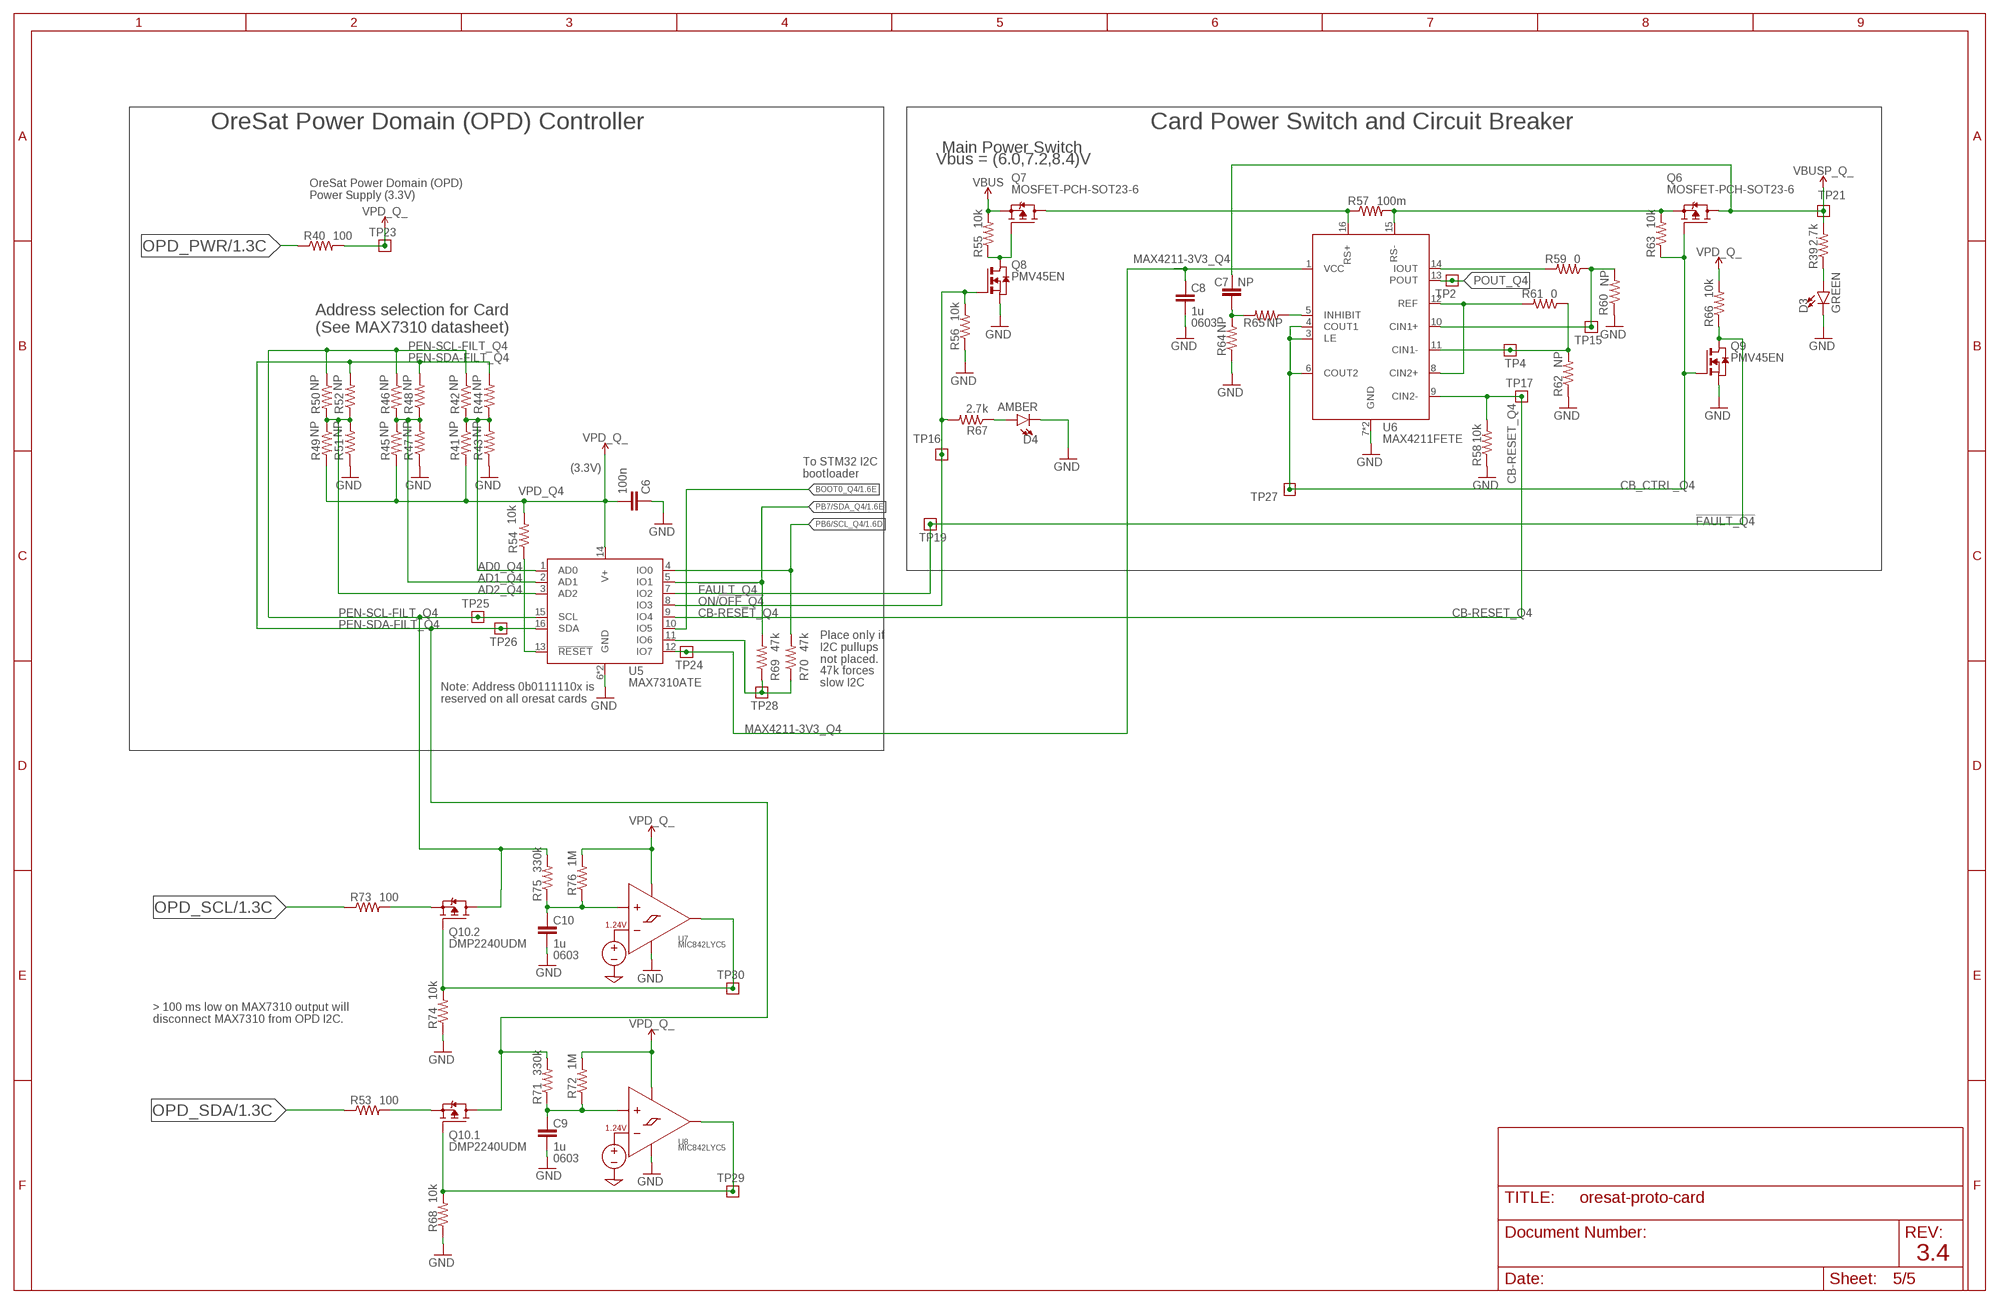
[diagram p4: schematic, sheet 5]

### Parts
C6  100n  C-EU0402-B-NOSILK  [.0402-B-NOSILK]
C7  NP  C-EU0402-B-NOSILK  [.0402-B-NOSILK]
C8  1u  C-EU0603-B-NOSILK  [.0603-B-NOSILK]
C9  1u  C-EU0603-B-NOSILK  [.0603-B-NOSILK]
C10  1u  C-EU0603-B-NOSILK  [.0603-B-NOSILK]
D3  GREEN  LED-GREEN0603  [LED-0603]
D4  AMBER  LED-GREEN0603  [LED-0603]
Q6  MOSFET-PCH-SOT23-6  [SOT23-6]
Q7  MOSFET-PCH-SOT23-6  [SOT23-6]
Q8  PMV45EN  [SOT23]
Q9  PMV45EN  [SOT23]
Q10  DMP2240UDM  MOSFET-PCH-SOT23-6  [SOT23-6]
R39  2.7k  R-US_0402-B-NOSILK  [.0402-B-NOSILK]
R40  100  R-US_0402-B-NOSILK  [.0402-B-NOSILK]
R41  NP  R-US_0402-B-NOSILK  [.0402-B-NOSILK]
R42  NP  R-US_0402-B-NOSILK  [.0402-B-NOSILK]
R43  NP  R-US_0402-B-NOSILK  [.0402-B-NOSILK]
R44  NP  R-US_0402-B-NOSILK  [.0402-B-NOSILK]
R45  NP  R-US_0402-B-NOSILK  [.0402-B-NOSILK]
R46  NP  R-US_0402-B-NOSILK  [.0402-B-NOSILK]
R47  NP  R-US_0402-B-NOSILK  [.0402-B-NOSILK]
R48  NP  R-US_0402-B-NOSILK  [.0402-B-NOSILK]
R49  NP  R-US_0402-B-NOSILK  [.0402-B-NOSILK]
R50  NP  R-US_0402-B-NOSILK  [.0402-B-NOSILK]
R51  NP  R-US_0402-B-NOSILK  [.0402-B-NOSILK]
R52  NP  R-US_0402-B-NOSILK  [.0402-B-NOSILK]
R53  100  R-US_0402-B-NOSILK  [.0402-B-NOSILK]
R54  10k  R-US_0402-B-NOSILK  [.0402-B-NOSILK]
R55  10k  R-US_0402-B-NOSILK  [.0402-B-NOSILK]
R56  10k  R-US_0402-B-NOSILK  [.0402-B-NOSILK]
R57  100m  R-US_R1206  [R1206]
R58  10k  R-US_0402-B-NOSILK  [.0402-B-NOSILK]
R59  0  R-US_0402-B-NOSILK  [.0402-B-NOSILK]
R60  NP  R-US_0402-B-NOSILK  [.0402-B-NOSILK]
R61  0  R-US_0402-B-NOSILK  [.0402-B-NOSILK]
R62  NP  R-US_0402-B-NOSILK  [.0402-B-NOSILK]
R63  10k  R-US_0402-B-NOSILK  [.0402-B-NOSILK]
R64  NP  R-US_0402-B-NOSILK  [.0402-B-NOSILK]
R65  NP  R-US_0402-B-NOSILK  [.0402-B-NOSILK]
R66  10k  R-US_0402-B-NOSILK  [.0402-B-NOSILK]
R67  2.7k  R-US_0402-B-NOSILK  [.0402-B-NOSILK]
R68  10k  R-US_0402-B-NOSILK  [.0402-B-NOSILK]
R69  47k  R-US_0402-B-NOSILK  [.0402-B-NOSILK]
R70  47k  R-US_0402-B-NOSILK  [.0402-B-NOSILK]
R71  330k  R-US_0402-B-NOSILK  [.0402-B-NOSILK]
R72  1M  R-US_0402-B-NOSILK  [.0402-B-NOSILK]
R73  100  R-US_0402-B-NOSILK  [.0402-B-NOSILK]
R74  10k  R-US_0402-B-NOSILK  [.0402-B-NOSILK]
R75  330k  R-US_0402-B-NOSILK  [.0402-B-NOSILK]
R76  1M  R-US_0402-B-NOSILK  [.0402-B-NOSILK]
TP2  TEST-POINT  [2MM-TEST-POINT]
TP4  TEST-POINT  [2MM-TEST-POINT]
TP15  TEST-POINT  [2MM-TEST-POINT]
TP16  TEST-POINT  [2MM-TEST-POINT]
TP17  TEST-POINT  [2MM-TEST-POINT]
TP19  TEST-POINT  [2MM-TEST-POINT]
TP21  TEST-POINT  [2MM-TEST-POINT]
TP23  TEST-POINT  [2MM-TEST-POINT]
TP24  TEST-POINT  [2MM-TEST-POINT]
TP25  TEST-POINT  [2MM-TEST-POINT]
TP26  TEST-POINT  [2MM-TEST-POINT]
TP27  TEST-POINT  [2MM-TEST-POINT]
TP28  TEST-POINT  [2MM-TEST-POINT]
TP29  TEST-POINT  [2MM-TEST-POINT]
TP30  TEST-POINT  [2MM-TEST-POINT]
U5  MAX7310ATE  MAX7310  [QFN65P400X400X80-17T210]
U6  MAX4211FETE  MAX4211  [QFN65P400X400X80-17T210]
U7  MIC842LYC5  [SC70-5]
U8  MIC842LYC5  [SC70-5]

### Nets
!FAULT_Q4: Q9.3(D) R66.1 TP19.1 U5.7(IO2)
AD0_Q4: R41.1 R42.2 R43.2 R44.1 U5.1(AD0)
AD1_Q4: R45.1 R46.2 R47.2 R48.1 U5.2(AD1)
AD2_Q4: R49.1 R50.2 R51.2 R52.1 U5.3(AD2)
BOOT0_Q4: U5.10(IO5) ; also sheet 1
CB-RESET_Q4: R58.2 TP17.1 U5.9(IO4) U6.9(CIN2-)
CB_CTRL_Q4: Q6.3(G) Q9.1(G) R63.1 TP27.1 U6.3(LE) U6.4(COUT1) U6.6(COUT2)
GND: C6.1 C8.2 C9.2 C10.2 D3.C D4.C Q8.2(S) Q9.2(S) R43.1 R47.1 R51.1 R56.1 R58.1 R60.1 R62.1 R64.1 R68.1 R74.1 U5.6(GND) U5.EPAD(GND) U6.7(GND) U6.EPAD(GND) U7.2(GND) U8.2(GND) ; also sheet 1,2,3,4
IOUT_Q4: R59.2 U6.14(IOUT)
MAX4211-3V3_Q4: C8.1 TP24.1 U5.12(IO7) U6.1(VCC)
N$5: D3.A R39.1
N$6: R54.1 U5.13(!RESET)
N$7: Q7.3(G) Q8.3(D) R55.1
N$8: Q7.1(D) Q7.2(D) Q7.5(D) Q7.6(D) R57.1 U6.16(RS+)
N$9: R59.1 R60.2 TP15.1 U6.10(CIN1+)
N$10: R61.1 R62.2 TP4.1 U6.11(CIN1-)
N$11: R61.2 U6.8(CIN2+) U6.12(REF)
N$12: R65.1 U6.5(INHIBIT)
N$13: C7.1 R64.2 R65.2
N$14: Q6.4(S) R57.2 R63.2 U6.15(RS-)
N$15: D4.A R67.1
N$16: Q10.5(.1:S) R53.2
N$17: Q10.1(.1:G) R68.2 TP29.1 U8.4(OUT)
N$18: R69.1 R70.1 TP28.1 U5.11(IO6)
N$19: Q10.2(.2:S) R73.2
N$20: Q10.3(.2:G) R74.2 TP30.1 U7.4(OUT)
N$21: C10.1 R75.1 R76.1 U7.1(INP)
N$22: C9.1 R71.1 R72.1 U8.1(INP)
ON/!OFF_Q4: Q8.1(G) R56.2 R67.2 TP16.1 U5.8(IO3)
OPD_PWR: R40.1 ; also sheet 1,2,3,4
OPD_SCL: R73.1 ; also sheet 1,2,3,4
OPD_SDA: R53.1 ; also sheet 1,2,3,4
PB6/SCL_Q4: R70.2 U5.4(IO0) ; also sheet 1
PB7/SDA_Q4: R69.2 U5.5(IO1) ; also sheet 1
PEN-SCL-FILT_Q4: Q10.4(.2:D) R42.1 R46.1 R50.1 R75.2 TP25.1 U5.15(SCL)
PEN-SDA-FILT_Q4: Q10.6(.1:D) R44.2 R48.2 R52.2 R71.2 TP26.1 U5.16(SDA)
POUT_Q4: TP2.1 U6.13(POUT)
VBUS: Q7.4(S) R55.2 ; also sheet 1,2,3,4
VBUSP_Q4: C7.2 Q6.1(D) Q6.2(D) Q6.5(D) Q6.6(D) R39.2 TP21.1 ; supply symbol labelled VBUSP_Q_ ; also sheet 1
VPD_Q4: C6.2 R40.2 R41.2 R45.2 R49.2 R54.2 R66.2 R72.2 R76.2 TP23.1 U5.14(V+) U7.5(VDD) U8.5(VDD) ; supply symbol labelled VPD_Q_

### Notes on the sheet
- OreSat Power Domain (OPD) Controller | Card Power Switch and Circuit Breaker
- Main Power Switch
- Vbus = (6.0,7.2,8.4)V
- OreSat Power Domain (OPD)
  Power Supply (3.3V)
- 0603
- Address selection for Card
  (See MAX7310 datasheet)
- (3.3V)
- To STM32 I2C
  bootloader
- Place only if
  I2C pullups
  not placed.
- 47k forces
  slow I2C
- Note: Address 0b0111110x is 
  reserved on all oresat cards
- 0603
- > 100 ms low on MAX7310 output will
  disconnect MAX7310 from OPD I2C.
- 0603
- 3.4

## Library data of the parts
C6 C11 C21 C31 = rcl_custom:C-EU: CAPACITOR, European symbol; DIS: Digi-Key; DPN: 1276-1001-1-ND; MFR: Samsung; MPN: CL05B104KO5NNNC
C7 C12 C22 C32 = rcl_custom:C-EU: CAPACITOR, European symbol
C8-C10 C13-C15 C23-C25 C33-C35 = oresat-rcl:C-EU: CAPACITOR, European symbol; DIS: Digi-Key; DPN: 311-1446-1-ND; MFR: Yageo; MPN: CC0603KRX7R7BB105
D3 D5 D9 D13 = SparkFun-LED:LED-GREEN: Green SMD LED Used in manufacturing of various products at SparkFun Packages: 0603 - SMD 0603 package [Product Link] <http://www.futureelectronics.com/en/technologies/semiconductors/optoelectronics/leds/Pages/9894312-LTST-C190GKT.aspx?CrossPart=HSMG-C190&IM=0> LilyPad 1206 - SMD1206 LilyPad package [Product Link] <http://www.futureelectronics.com/en/Technologies/Product.aspx?ProductID=IN150NGHARVATEKCORPORATION2049943&IM=0> 1206 - SMD1206 package [Product Link] <http://www.futureelectronics.com/en/technologies/semiconductors/optoelectronics/leds/Pages/8315665-LTST-C150KGKT.aspx?IM=0> 1206 Bottom Mount -SMD 1206 Bottom Mount [Product Link] <http://www.digikey.com/product-detail/en/lite-on-inc/LTST-C230KGKT/160-1456-1-ND/386854> SparkFun Products: Pro Mini 328 -5V <https://www.sparkfun.com/products/821> RedBoard <https://www.sparkfun.com/products/12757> MP3 Trigger <https://www.sparkfun.com/products/13720> Makey Makey <https://www.sparkfun.com/products/11076>; DIS: Digi-Key; DPN: 511-1584-1-ND; MFR: Rohm; MPN: SML-E12M8WT86
D4 D6 D10 D14 = SparkFun-LED:LED-GREEN: Green SMD LED Used in manufacturing of various products at SparkFun Packages: 0603 - SMD 0603 package [Product Link] <http://www.futureelectronics.com/en/technologies/semiconductors/optoelectronics/leds/Pages/9894312-LTST-C190GKT.aspx?CrossPart=HSMG-C190&IM=0> LilyPad 1206 - SMD1206 LilyPad package [Product Link] <http://www.futureelectronics.com/en/Technologies/Product.aspx?ProductID=IN150NGHARVATEKCORPORATION2049943&IM=0> 1206 - SMD1206 package [Product Link] <http://www.futureelectronics.com/en/technologies/semiconductors/optoelectronics/leds/Pages/8315665-LTST-C150KGKT.aspx?IM=0> 1206 Bottom Mount -SMD 1206 Bottom Mount [Product Link] <http://www.digikey.com/product-detail/en/lite-on-inc/LTST-C230KGKT/160-1456-1-ND/386854> SparkFun Products: Pro Mini 328 -5V <https://www.sparkfun.com/products/821> RedBoard <https://www.sparkfun.com/products/12757> MP3 Trigger <https://www.sparkfun.com/products/13720> Makey Makey <https://www.sparkfun.com/products/11076>; DIS: Digi-Key; DPN: 1830-1064-1-ND; MFR: Inolux; MPN: IN-S63AT5A; VALUE: GREEN
H1-H4 = SparkFun-Hardware:STAND-OFF: Stand Off Drill holes for mechanically mounting via screws, standoffs, etc. Note: Use the keepout ring to avoid running the screw head into surrounding components. Variant Overviews STAND-OFF - Mechanical footprint for a #4 phillips button head screw. STAND-OFF-TIGHT - Mechanical footprint for a #4 phillips button head screw, Example SparkFun Products Screw - Phillips Head (1/4", 4-40, 10 pack) <https://www.sparkfun.com/products/10453> (PRT-10453) Screw - Phillips Head (1/2", 4-40, 10 pack) <https://www.sparkfun.com/products/10452> (PRT-10452) Screw - Phillips Head (3/4", 4-40, 10 pack) <https://www.sparkfun.com/products/10451> (PRT-10451) Screw - Phillips Head (1", 4-40, 10 pack) <https://www.sparkfun.com/products/10450> (PRT-10450)
J6 = J-Samtec-TFM-120-X1-XXX-D-RA:J-SAMTEC-TFM-120-X1-XXX-D-RA; MFR: Samtec; MPN: TFM-120-01-L-D-RA
JP10 = pinhead:PINHD-2X5: PIN HEADER
Q6 Q7 Q11 Q12 Q21 Q22 Q31 Q32 = Q-MOSFET-PCH-SOT23-6:MOSFET-PCH-SOT23-6: P channel MOSFET in an SOT23-6; DIS: Digi-Key; DPN: DMP3050LVT-7DICT-ND; MFR: Diodes Inc; MPN: DMP3050LVT-7
Q8 Q9 Q13 Q14 Q23 Q24 Q33 Q34 = Tova:PMV45EN; DIS: Digi-Key; DPN: 1727-2307-1-ND; MFR: Nexperia; MPN: PMV45EN2R
Q10 Q15 Q25 Q35 = Q-MOSFET-PCH-dual-SOT23-6:MOSFET-PCH-SOT23-6: Dual P channel MOSFETs in an SOT23-6; DIS: Digi-Key; DPN: DMP2240UDMDICT-ND; MFR: Diodes Inc; MPN: DMP2240UDM
R39 R67 R77 R105 R153 R181 R229 R257 = rcl_custom:R-US_: RESISTOR, American symbol; DIS: Digi-Key; DPN: A129632CT-ND; MFR: TE Connectivity; MPN: CRGCQ0402F2K7
R40 R53 R73 R78 R91 R111 R154 R167 R187 R230 R243 R263 = rcl_custom:R-US_: RESISTOR, American symbol; DIS: Digi-Key; DPN: 311-100LRCT-ND; MFR: Yageo; MPN: RC0402FR-07100RL
R41-R52 R60 R62 R64 R65 R79-R90 R98 R100 R102 R103 R155-R166 R174 R176 R178 R179 R231-R242 R250 R252 R254 R255 = rcl_custom:R-US_: RESISTOR, American symbol; DIS: Digi-Key; DPN: 1276-4275-1-ND; MFR: Samsung; MPN: RC1005F6653CS
R54-R56 R58 R63 R66 R68 R74 R92-R94 R96 R101 R104 R106 R112 R168-R170 R172 R177 R180 R182 R188 R244-R246 R248 R253 R256 R258 R264 = rcl_custom:R-US_: RESISTOR, American symbol; DIS: Digi-Key; DPN: 311-10.0KLRCT-ND; MFR: Yageo; MPN: RC0402FR-0710KL
R57 R95 R171 R247 = rcl:R-US_: RESISTOR, American symbol; DIS: Digi-Key; DPN: CSR1206FTR100CT-ND; MFR: Stackpole; MPN: CSR1206FTR100; SPICEPREFIX: R
R59 R61 R97 R99 R173 R175 R249 R251 = rcl_custom:R-US_: RESISTOR, American symbol; DIS: Digi-Key; DPN: 311-0.0JRCT-ND; MFR: Yageo; MPN: RC0402JR-070RL
R69 R70 R107 R108 R183 R184 R259 R260 = rcl_custom:R-US_: RESISTOR, American symbol; DIS: Digi-Key; DPN: 311-47.0KLRCT-ND; MFR: Yageo; MPN: RC0402FR-0747KL
R71 R75 R109 R113 R185 R189 R261 R265 = rcl_custom:R-US_: RESISTOR, American symbol; DIS: Digi-Key; DPN: 749-1575-1-ND; MFR: Vishay; MPN: MCS04020C3303FE000
R72 R76 R110 R114 R186 R190 R262 R266 = rcl_custom:R-US_: RESISTOR, American symbol; DIS: Digi-Key; DPN: 311-1.00MLRCT-ND; MFR: Yageo; MPN: RC0402FR-071ML
TP2 TP4 TP15-TP17 TP19 TP21 TP23-TP45 TP61-TP75 TP91-TP105 = Tova:TEST-POINT
U5 U9 U17 U25 = U-Maxim-MAX7310-I2C-GPIO-expander:MAX7310; DIS: Digi-Key; DPN: MAX7310ATE+-ND; MFR: Maxim; MPN: MAX7310ATE
U6 U10 U18 U26 = U-Maxim-MAX4211-power-monitor:MAX4211; DIS: Digi-Key; DPN: MAX4211FETE+-ND; MFR: Maxim; MPN: MAX4211FETE
U7 U8 U11 U12 U19 U20 U27 U28 = U-Microchip-MIC842-Comparator:MIC842L
U$1 U$3-U$5 = oresat-ACS_driver_board:MEZZANINE_PLUG
U$2 = oresat-cards:ORESAT-CARD-V1.1

## Board
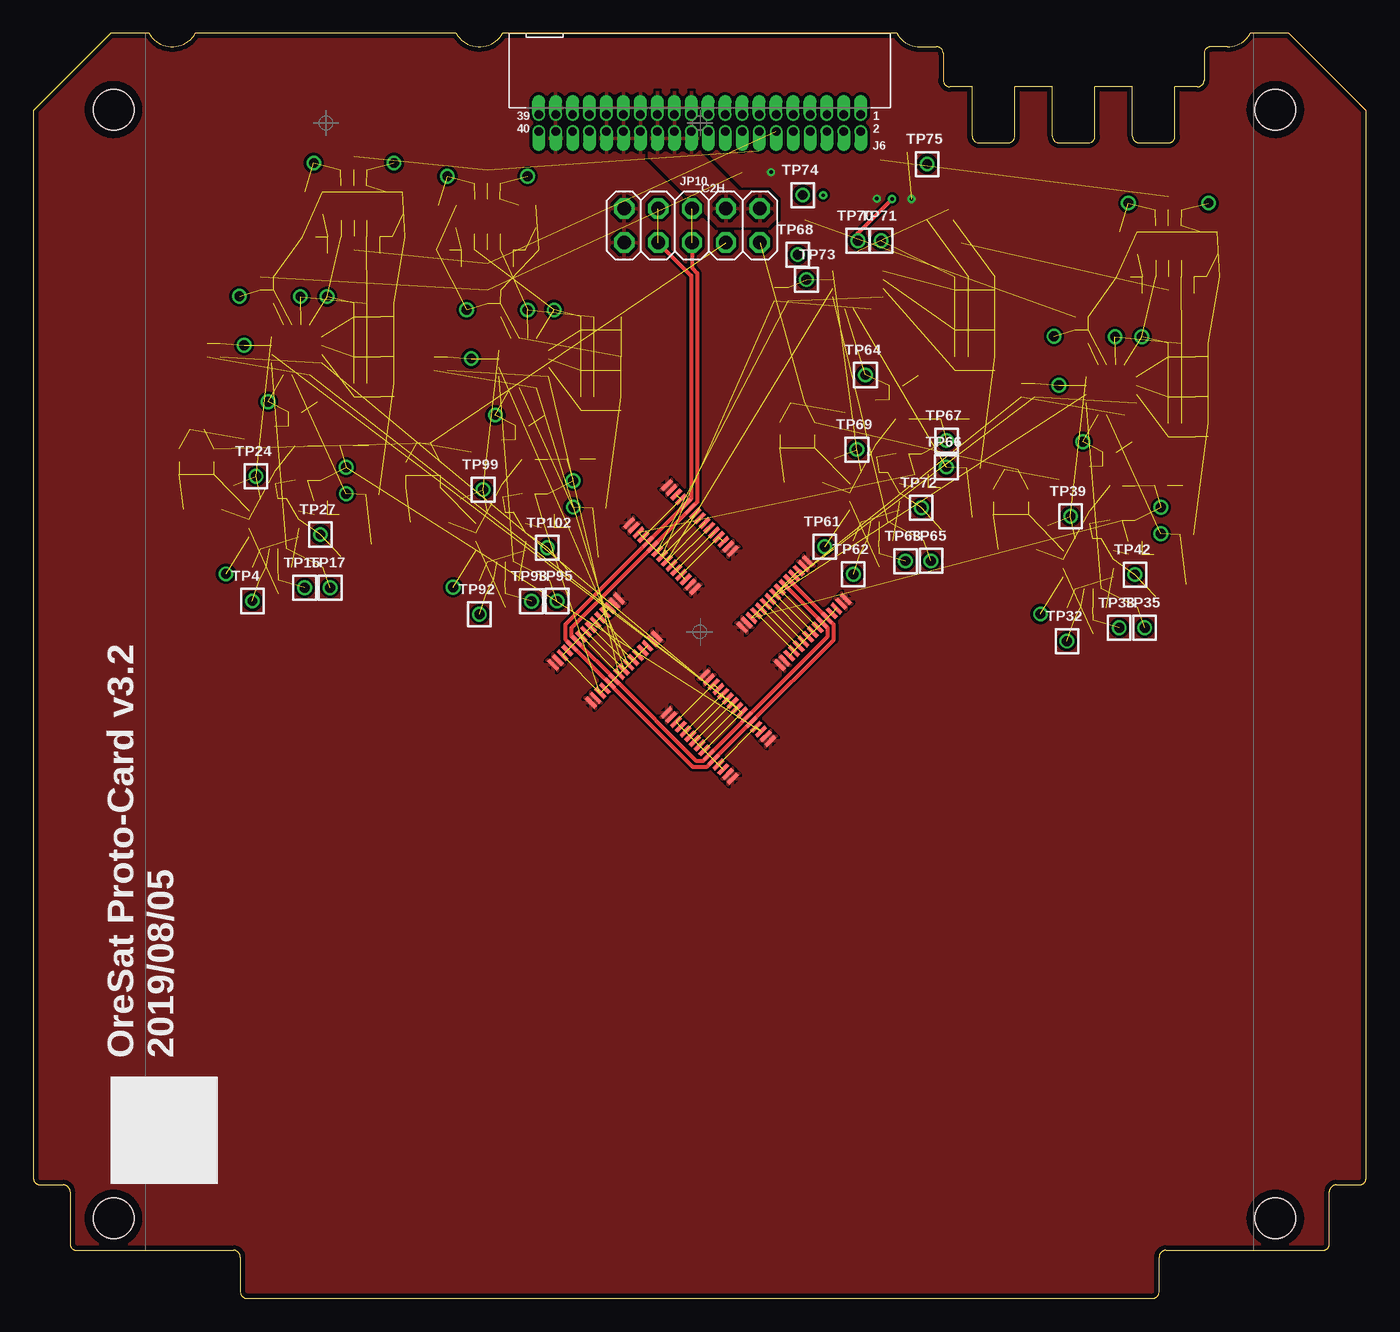
[diagram p5: board, top side]
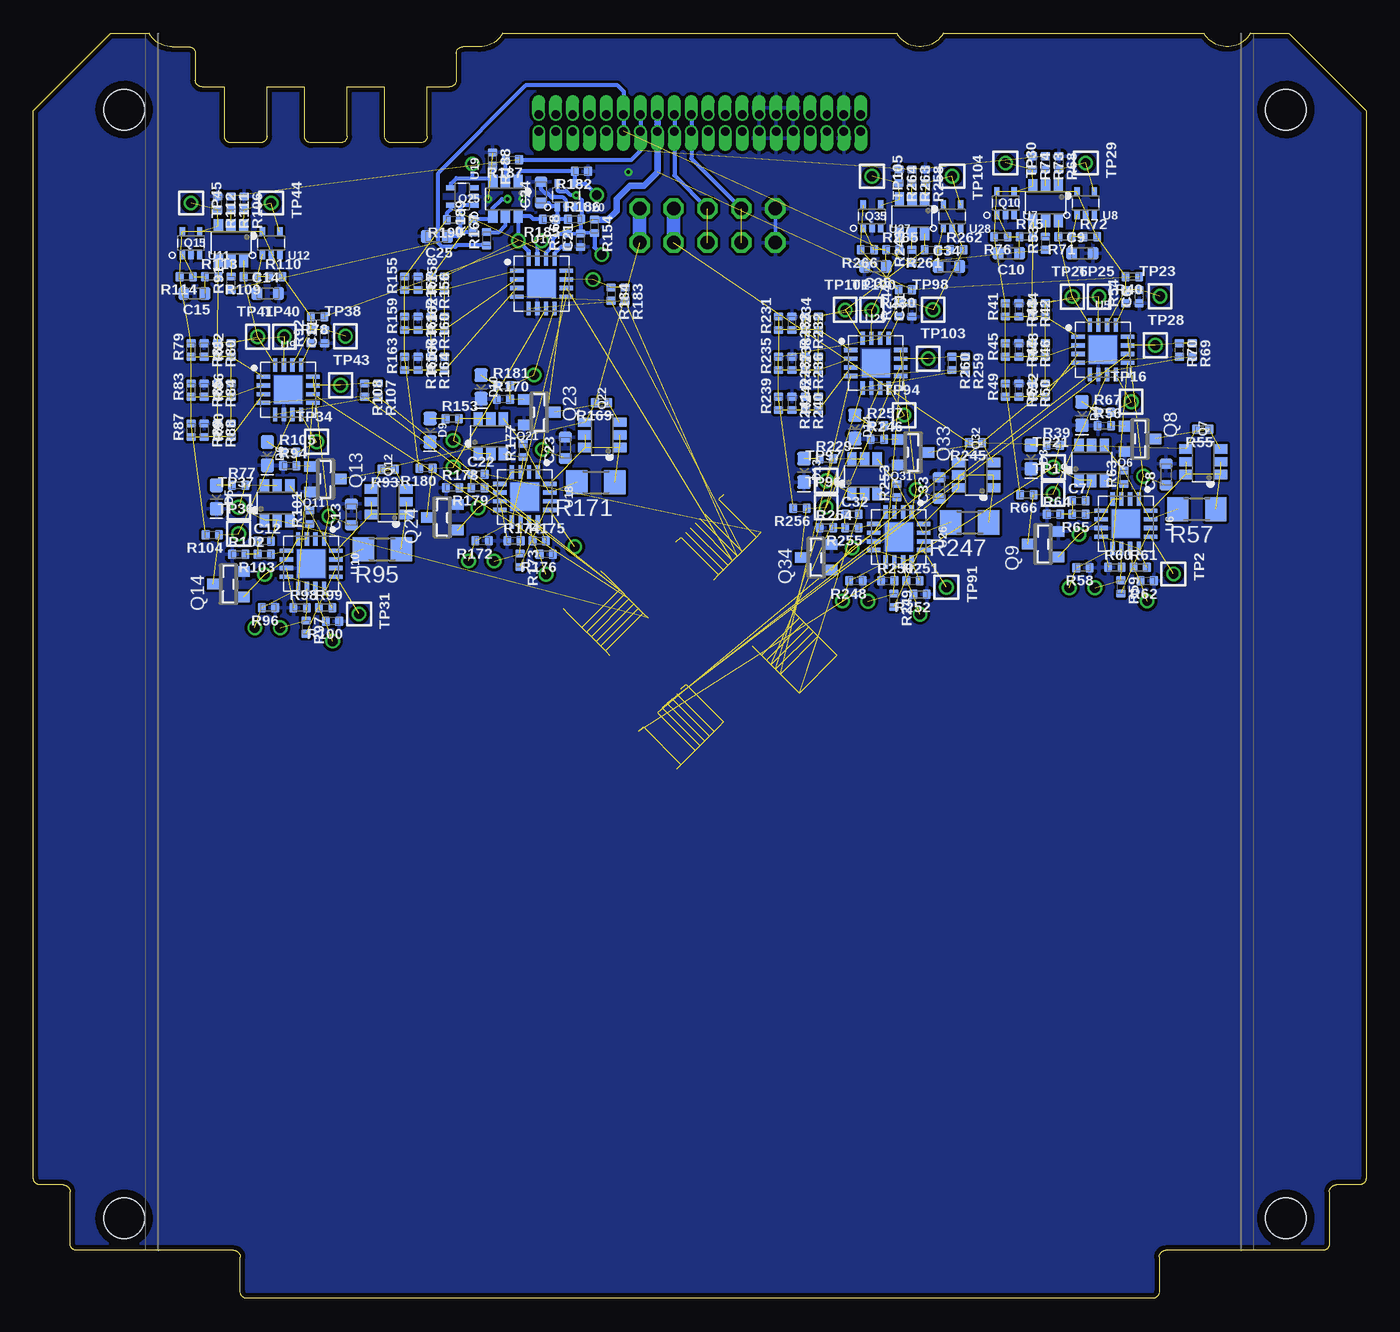
[diagram p6: board, bottom side, seen from below]

Size 99.8 x 94.7 mm. Coordinates in mm from the lower left corner, seen from the top.
Copper layers (1*16): Top 0.0356mm / dielectric 1.5011mm / Bottom 0.0356mm
Design rules "OSH-Park-2-layer *": minimum track width 6mil, minimum drill 10mil, track to track 6mil, track to pad 6mil, pad to pad 6mil, via to via 6mil, smd to smd 6mil, copper to edge 15mil, drill to drill 6mil, minimum pad ring 7mil, minimum via ring 7mil, stop-mask expansion 3mil, vias tented up to drill 13mil, thermal gap 10mil

### Footprints (pad centres in the part's own frame; a part is rotated, then mirrored left to right if it is on the bottom)
.0402-B-NOSILK = smd 0.6 x 0.7: 1 -0.5,0; 2 0.5,0
.0603-B-NOSILK = smd 0.8 x 0.95: 1 -0.8,0; 2 0.8,0
LED-0603 = smd 1 x 1: A -0.877,0; C 0.877,0
STAND-OFF-TIGHT = hole 3.048: 0,0
J-SAMTEC-TFM-120-X1-XXX-D-RA = drill 0.635 pad 0.965 offset: 1 12.065,0.635; 2 12.065,-0.635; 3 10.795,0.635; 4 10.795,-0.635; 5 9.525,0.635; 6 9.525,-0.635; 7 8.255,0.635; 8 8.255,-0.635; 9 6.985,0.635; 10 6.985,-0.635; 11 5.715,0.635; 12 5.715,-0.635; 13 4.445,0.635; 14 4.445,-0.635; 15 3.175,0.635; 16 3.175,-0.635; 17 1.905,0.635; 18 1.905,-0.635; 19 0.635,0.635; 20 0.635,-0.635; 21 -0.635,0.635; 22 -0.635,-0.635; 23 -1.905,0.635; 24 -1.905,-0.635; 25 -3.175,0.635; 26 -3.175,-0.635; 27 -4.445,0.635; 28 -4.445,-0.635; 29 -5.715,0.635; 30 -5.715,-0.635; 31 -6.985,0.635; 32 -6.985,-0.635; 33 -8.255,0.635; 34 -8.255,-0.635; 35 -9.525,0.635; 36 -9.525,-0.635; 37 -10.795,0.635; 38 -10.795,-0.635; 39 -12.065,0.635; 40 -12.065,-0.635
2X05 = drill 1.016 octagon: 1 -5.08,-1.27; 2 -5.08,1.27; 3 -2.54,-1.27; 4 -2.54,1.27; 5 0,-1.27; 6 0,1.27; 7 2.54,-1.27; 8 2.54,1.27; 9 5.08,-1.27; 10 5.08,1.27
SOT23-6 = smd 0.7 x 1: 1 -0.95,-1.3; 2 0,-1.3; 3 0.95,-1.3; 4 0.95,1.3; 5 0,1.3; 6 -0.95,1.3
SOT23 = smd 0.787 x 0.889: 1 -0.953,-1.143; 2 0.953,-1.143; 3 0,1.143
R1206 = smd 1.6 x 1.803: 1 -1.422,0; 2 1.422,0
2MM-TEST-POINT = drill 0.737: 1 0,0
QFN65P400X400X80-17T210 = smd 1.01 x 0.32: 1 -1.86,0.975; 2 -1.86,0.325; 3 -1.86,-0.325; 4 -1.86,-0.975; 9 1.86,-0.975; 10 1.86,-0.325; 11 1.86,0.325; 12 1.86,0.975 | smd 0.32 x 1.01: 5 -0.975,-1.86; 6 -0.325,-1.86; 7 0.325,-1.86; 8 0.975,-1.86; 13 0.975,1.86; 14 0.325,1.86; 15 -0.325,1.86; 16 -0.975,1.86 | smd 2.1 x 2.1: EPAD 0,0
SC70-5 = smd 0.4 x 0.7: 1 -0.65,-0.85; 2 0,-0.85; 3 0.65,-0.85; 4 0.65,0.85; 5 -0.65,0.85
MEZZANINE_PLUG = smd 0.3 x 1: P$1 -3.5,2; P$2 -3,2; P$3 -2.5,2; P$4 -2,2; P$5 -1.5,2; P$6 -1,2; P$7 -0.5,2; P$8 0,2; P$9 0.5,2; P$10 1,2; P$11 1.5,2; P$12 2,2; P$13 2.5,2; P$14 3,2; P$15 3.5,2; P$16 3.5,-2; P$17 3,-2; P$18 2.5,-2; P$19 2,-2; P$20 1.5,-2; P$21 1,-2; P$22 0.5,-2; P$23 0,-2; P$24 -0.5,-2; P$25 -1,-2; P$26 -1.5,-2; P$27 -2,-2; P$28 -2.5,-2; P$29 -3,-2; P$30 -3.5,-2

### Placement (x,y rotation side)
C6  17,75 90 bottom
C7  21.51,59.7 0 bottom
C8  14.98,61.68 90 bottom
C9  21.25,78.24 0 bottom
C10  26.75,78.24 180 bottom
C11  78,72 90 bottom
C12  82.51,56.7 0 bottom
C13  75.98,58.68 90 bottom
C14  82.25,75.24 0 bottom
C15  87.75,75.24 180 bottom
C21  58.84,79.22 90 bottom
C22  66.51,61.7 0 bottom
C23  59.98,63.68 90 bottom
C24  61.78,82.8 90 bottom
C25  69.59,79.5 180 bottom
C31  34,74 90 bottom
C32  38.51,58.7 0 bottom
C33  31.98,60.68 90 bottom
C34  31.25,77.24 0 bottom
C35  36.75,77.24 180 bottom
D3  25.09,62.99 270 bottom
D4  21.28,66.24 270 bottom
D5  86.09,59.99 270 bottom
D6  82.28,63.24 270 bottom
D9  70.09,64.99 270 bottom
D10  66.28,68.24 270 bottom
D13  42.09,61.99 270 bottom
D14  38.28,65.24 270 bottom
H1  93,6 0 top
H2  93,89 0 top
H3  6,89 0 top
H4  6,6 0 top
J6  49.9,87.99 0 top
JP10  49.32,80.31 180 top
Q6  20.55,62.54 0 bottom
Q7  12.2,62.64 90 bottom
Q8  16.93,64.34 270 bottom
Q9  24.19,56.47 90 bottom
Q10  24,82 180 bottom
Q11  81.55,59.54 0 bottom
Q12  73.2,59.64 90 bottom
Q13  77.93,61.34 270 bottom
Q14  85.19,53.47 90 bottom
Q15  85,79 180 bottom
Q21  65.55,64.54 0 bottom
Q22  57.2,64.64 90 bottom
Q23  61.93,66.34 270 bottom
Q24  69.19,58.47 90 bottom
Q25  64.45,82.31 180 bottom
Q31  37.55,61.54 0 bottom
Q32  29.2,61.64 90 bottom
Q33  33.93,63.34 270 bottom
Q34  41.19,55.47 90 bottom
Q35  34,81 180 bottom
R39  23.43,63.87 0 bottom
R40  17.51,76.5 180 bottom
R41  27,74 90 bottom
R42  25,74 270 bottom
R43  26,74 270 bottom
R44  24,74 90 bottom
R45  27,71 90 bottom
R46  25,71 270 bottom
R47  26,71 270 bottom
R48  24,71 90 bottom
R49  27,68 90 bottom
R50  25,68 270 bottom
R51  26,68 270 bottom
R52  24,68 90 bottom
R53  24,79 90 bottom
R54  18,75 90 bottom
R55  12.24,65.06 180 bottom
R56  19.6,65.33 0 bottom
R57  12.68,59.09 180 bottom
R58  21.2,54.71 180 bottom
R59  18.37,53.26 270 bottom
R60  18.82,54.72 0 bottom
R61  16.92,54.72 0 bottom
R62  16.4,53.71 180 bottom
R63  18.13,61.48 90 bottom
R64  23.41,58.7 0 bottom
R65  21.51,58.7 180 bottom
R66  25.4,60.16 180 bottom
R67  19.6,66.34 0 bottom
R68  23,85 270 bottom
R69  13,71 270 bottom
R70  14,71 270 bottom
R71  22.55,79.49 180 bottom
R72  20.65,79.49 0 bottom
R73  24,85 270 bottom
R74  25,85 270 bottom
R75  25.45,79.49 0 bottom
R76  27.35,79.49 180 bottom
R77  84.43,60.87 0 bottom
R78  78.51,73.5 180 bottom
R79  88,71 90 bottom
R80  86,71 270 bottom
R81  87,71 270 bottom
R82  85,71 90 bottom
R83  88,68 90 bottom
R84  86,68 270 bottom
R85  87,68 270 bottom
R86  85,68 90 bottom
R87  88,65 90 bottom
R88  86,65 270 bottom
R89  87,65 270 bottom
R90  85,65 90 bottom
R91  85,76 90 bottom
R92  79,72 90 bottom
R93  73.24,62.06 180 bottom
R94  80.6,62.33 0 bottom
R95  73.68,56.09 180 bottom
R96  82.2,51.71 180 bottom
R97  79.37,50.26 270 bottom
R98  79.82,51.72 0 bottom
R99  77.92,51.72 0 bottom
R100  77.4,50.71 180 bottom
R101  79.13,58.48 90 bottom
R102  84.41,55.7 0 bottom
R103  82.51,55.7 180 bottom
R104  86.4,57.16 180 bottom
R105  80.6,63.34 0 bottom
R106  84,82 270 bottom
R107  74,68 270 bottom
R108  75,68 270 bottom
R109  83.55,76.49 180 bottom
R110  81.65,76.49 0 bottom
R111  85,82 270 bottom
R112  86,82 270 bottom
R113  86.45,76.49 0 bottom
R114  88.35,76.49 180 bottom
R153  68.43,65.87 0 bottom
R154  57.78,80.26 270 bottom
R155  72,76 90 bottom
R156  70,76 270 bottom
R157  71,76 270 bottom
R158  69,76 90 bottom
R159  72,73 90 bottom
R160  70,73 270 bottom
R161  71,73 270 bottom
R162  69,73 90 bottom
R163  72,70 90 bottom
R164  70,70 270 bottom
R165  71,70 270 bottom
R166  69,70 90 bottom
R167  65.85,79.33 90 bottom
R168  59.85,79.22 90 bottom
R169  57.24,67.06 180 bottom
R170  64.6,67.33 0 bottom
R171  57.68,61.09 180 bottom
R172  66.2,56.71 180 bottom
R173  63.37,55.26 270 bottom
R174  63.82,56.72 0 bottom
R175  61.92,56.72 0 bottom
R176  61.4,55.71 180 bottom
R177  63.13,63.48 90 bottom
R178  68.41,60.7 0 bottom
R179  66.51,60.7 180 bottom
R180  70.4,62.16 180 bottom
R181  64.6,68.34 0 bottom
R182  58.77,84.39 180 bottom
R183  55.51,75.19 270 bottom
R184  56.53,75.19 270 bottom
R185  61.16,80.79 180 bottom
R186  59.26,80.79 0 bottom
R187  63.93,85.23 180 bottom
R188  65.42,85.29 270 bottom
R189  66.89,80.3 90 bottom
R190  68.35,80.75 180 bottom
R229  40.43,62.87 0 bottom
R230  34.51,75.5 180 bottom
R231  44,73 90 bottom
R232  42,73 270 bottom
R233  43,73 270 bottom
R234  41,73 90 bottom
R235  44,70 90 bottom
R236  42,70 270 bottom
R237  43,70 270 bottom
R238  41,70 90 bottom
R239  44,67 90 bottom
R240  42,67 270 bottom
R241  43,67 270 bottom
R242  41,67 90 bottom
R243  34,78 90 bottom
R244  35,74 90 bottom
R245  29.24,64.06 180 bottom
R246  36.6,64.33 0 bottom
R247  29.68,58.09 180 bottom
R248  38.2,53.71 180 bottom
R249  35.37,52.26 270 bottom
R250  35.82,53.72 0 bottom
R251  33.92,53.72 0 bottom
R252  33.4,52.71 180 bottom
R253  35.13,60.48 90 bottom
R254  40.41,57.7 0 bottom
R255  38.51,57.7 180 bottom
R256  42.4,59.16 180 bottom
R257  36.6,65.34 0 bottom
R258  33,84 270 bottom
R259  30,70 270 bottom
R260  31,70 270 bottom
R261  32.55,78.49 180 bottom
R262  30.65,78.49 0 bottom
R263  34,84 270 bottom
R264  35,84 270 bottom
R265  35.45,78.49 0 bottom
R266  37.35,78.49 180 bottom
TP2  14.42,54.24 270 bottom
TP4  16.4,52.21 0 top
TP15  20.31,53.2 0 top
TP16  17.59,67.13 0 bottom
TP17  22.22,53.21 0 top
TP19  23.43,60.24 0 bottom
TP21  23.42,62.22 0 bottom
TP23  15.43,75.02 0 bottom
TP24  16.67,61.55 0 top
TP25  20,75 0 bottom
TP26  22,75 0 bottom
TP27  21.49,57.19 0 top
TP28  15.79,71.36 0 bottom
TP29  21,85 270 bottom
TP30  27,85 270 bottom
TP31  75.42,51.24 270 bottom
TP32  77.4,49.21 0 top
TP33  81.31,50.2 0 top
TP34  78.59,64.13 0 bottom
TP35  83.22,50.21 0 top
TP36  84.43,57.24 0 bottom
TP37  84.42,59.22 0 bottom
TP38  76.43,72.02 0 bottom
TP39  77.67,58.55 0 top
TP40  81,72 0 bottom
TP41  83,72 0 bottom
TP42  82.49,54.19 0 top
TP43  76.79,68.36 0 bottom
TP44  82,82 270 bottom
TP45  88,82 270 bottom
TP61  59.26,56.28 0 top
TP62  61.4,54.21 0 top
TP63  65.31,55.2 0 top
TP64  62.31,69.13 0 top
TP65  67.22,55.21 0 top
TP66  68.37,62.24 0 top
TP67  68.38,64.22 0 top
TP68  57.24,78.14 0 top
TP69  61.67,63.55 0 top
TP70  61.74,79.18 0 top
TP71  63.49,79.17 0 top
TP72  66.49,59.19 0 top
TP73  57.89,76.27 0 top
TP74  57.61,82.6 0 top
TP75  66.93,84.92 0 top
TP91  31.42,53.24 270 bottom
TP92  33.4,51.21 0 top
TP93  37.31,52.2 0 top
TP94  34.59,66.13 0 bottom
TP95  39.22,52.21 0 top
TP96  40.43,59.24 0 bottom
TP97  40.42,61.22 0 bottom
TP98  32.43,74.02 0 bottom
TP99  33.67,60.55 0 top
TP100  37,74 0 bottom
TP101  39,74 0 bottom
TP102  38.49,56.19 0 top
TP103  32.79,70.36 0 bottom
TP104  31,84 270 bottom
TP105  37,84 270 bottom
U5  19.72,71.02 0 bottom
U6  18,58 270 bottom
U7  27,82 0 bottom
U8  21,82 0 bottom
U9  80.72,68.02 0 bottom
U10  79,55 270 bottom
U11  88,79 0 bottom
U12  82,79 0 bottom
U17  61.74,75.96 0 bottom
U18  63,60 270 bottom
U19  67.68,82.49 90 bottom
U20  59.91,82.6 0 bottom
U25  36.72,70.02 0 bottom
U26  35,57 270 bottom
U27  37,81 0 bottom
U28  31,81 0 bottom
U$1  56.96,51.3 225 top
U$2  0,0 0 top
U$3  48.49,56.99 315 top
U$4  42.8,48.5 45 top
U$5  51.3,42.8 135 top

### Tracks (layer width: path | path; a pad name or v marks a point on that pad's centre or on a via)
!FAULT_Q1  (3 unrouted)
!FAULT_Q2  (3 unrouted)
!FAULT_Q3  (3 unrouted)
!FAULT_Q4  (3 unrouted)
AD0_Q1  (4 unrouted)
AD0_Q2  (4 unrouted)
AD0_Q3  (4 unrouted)
AD0_Q4  (4 unrouted)
AD1_Q1  (4 unrouted)
AD1_Q2  (4 unrouted)
AD1_Q3  (4 unrouted)
AD1_Q4  (4 unrouted)
AD2_Q1  (4 unrouted)
AD2_Q2  (4 unrouted)
AD2_Q3  (4 unrouted)
AD2_Q4  (4 unrouted)
BOOT0_Q1  (2 unrouted)
BOOT0_Q2  (2 unrouted)
BOOT0_Q3  (2 unrouted)
BOOT0_Q4  (2 unrouted)
CAN2_H  (1 unrouted)
  Top 0.3: JP10.6 49.32,77.14 49.71,76.75 49.71,59.62 U$3.P$6 U$3.P$25 40.27,50.18 40.27,49.61 U$4.P$6 U$4.P$25 49.62,40.27 50.19,40.27 U$5.P$6 U$5.P$25 59.49,49.57 59.49,50.19 U$1.P$6 U$1.P$25
  Bottom 0.3: J6.17 J6.18 | J6.18 51.73,87.29 | J6.18 51.8,84.06 JP10.5
CAN2_L  (1 unrouted)
  Top 0.3: JP10.8 49.26,76.56 49.26,59.87 U$3.P$5 U$3.P$26 39.82,50.44 39.82,49.37 U$4.P$5 U$4.P$26 43.22,45.95 49.36,39.82 50.45,39.82 U$5.P$5 U$5.P$26 59.94,49.32 59.94,50.44 U$1.P$5 U$1.P$26
  Bottom 0.3: J6.19 J6.20 50.53,85.33 JP10.7
CB-RESET_Q1  (3 unrouted)
CB-RESET_Q2  (3 unrouted)
CB-RESET_Q3  (3 unrouted)
CB-RESET_Q4  (3 unrouted)
CB_CTRL_Q1  (6 unrouted)
CB_CTRL_Q2  (6 unrouted)
CB_CTRL_Q3  (6 unrouted)
CB_CTRL_Q4  (6 unrouted)
GND  (via drill 0.25)  (5 unrouted)
  Bottom 0.25: JP10.9 JP10.10 | U20.2
  Bottom 0.3: U20.2 59.91,82.2 60.13,82.42 60.99,82.42 61.3,82.73 61.47,82.73 61.78,83.04 C24.2
  other vias: 63.16,82.33 55.24,84.31 65.75,82.3
  pour Top (isolate 0.2, rank 6): 0,0 99.8,0 99.8,94.7 0,94.7
  pour Bottom (isolate 0.2, rank 6): 0,0 99.8,0 99.8,94.7 0,94.7
IOUT_Q1  (1 unrouted)
IOUT_Q2  (1 unrouted)
IOUT_Q4  (1 unrouted)
IOUT_Q_3  (1 unrouted)
MAG1_Q1  (1 unrouted)
MAG1_Q2  (1 unrouted)
MAG1_Q3  (1 unrouted)
MAG1_Q4  (1 unrouted)
MAG2_Q1  (1 unrouted)
MAG2_Q2  (1 unrouted)
MAG2_Q3  (1 unrouted)
MAG2_Q4  (1 unrouted)
MAX4211-3V3_Q1  (3 unrouted)
MAX4211-3V3_Q2  (3 unrouted)
MAX4211-3V3_Q3  (3 unrouted)
MAX4211-3V3_Q4  (3 unrouted)
N$5  (1 unrouted)
N$6  (1 unrouted)
N$7  (2 unrouted)
N$8  (5 unrouted)
N$9  (3 unrouted)
N$10  (3 unrouted)
N$11  (2 unrouted)
N$12  (1 unrouted)
N$13  (2 unrouted)
N$14  (3 unrouted)
N$15  (1 unrouted)
N$16  (1 unrouted)
N$17  (3 unrouted)
N$18  (3 unrouted)
N$19  (1 unrouted)
N$20  (3 unrouted)
N$21  (3 unrouted)
N$22  (3 unrouted)
N$169  (1 unrouted)
N$170  (1 unrouted)
N$171  (2 unrouted)
N$172  (5 unrouted)
N$173  (3 unrouted)
N$174  (3 unrouted)
N$175  (2 unrouted)
N$176  (1 unrouted)
N$177  (2 unrouted)
N$178  (3 unrouted)
N$179  (1 unrouted)
N$180  (1 unrouted)
N$181  (3 unrouted)
N$182  (3 unrouted)
N$183  (1 unrouted)
N$184  (3 unrouted)
N$185  (3 unrouted)
N$186  (3 unrouted)
N$205  (1 unrouted)
N$206
  Bottom 0.3: R168.1 60.27,78.72 60.77,78.22 U17.13
N$207  (2 unrouted)
N$208  (5 unrouted)
N$209  (3 unrouted)
N$210  (3 unrouted)
N$211  (2 unrouted)
N$212  (1 unrouted)
N$213  (2 unrouted)
N$214  (3 unrouted)
N$215  (1 unrouted)
N$216
  Bottom 0.3: R167.2 64.94,79.83 64.45,80.32 Q25.5
N$217
  Bottom 0.25: U20.4
  Bottom 0.3: U20.4 58.46,83.45 TP74.1 | Q25.1 63.5,84.2 63.31,84.39 R182.2 U20.4
N$218  (3 unrouted)
N$219
  Bottom 0.25: Q25.2 64.42,83.64
  Bottom 0.3: 64.42,83.64 R187.2
N$220
  Bottom 0.25: R188.2 65.4,84.77
  Bottom 0.3: U19.4 68.53,83.46 68.12,83.87 67,83.87 | 65.4,84.77 Q25.3 65.66,83.87 67,83.87 | TP75.1 66.93,83.94 67,83.87
N$221
  Bottom 0.3: U19.1 67.63,81.84 67.85,81.62 R190.1 67.85,79.71 | C25.1 68.06,79.5 67.85,79.71 | R189.1 67.76,79.8 67.85,79.71
N$222
  Bottom 0.25: R185.1 60.56,80.89
  Bottom 0.3: R186.1 R185.1 | 60.56,80.89 U20.1 60.97,81.75 61.22,82 C24.1
N$241  (1 unrouted)
N$242  (1 unrouted)
N$243  (2 unrouted)
N$244  (5 unrouted)
N$245  (3 unrouted)
N$246  (3 unrouted)
N$247  (2 unrouted)
N$248  (1 unrouted)
N$249  (2 unrouted)
N$250  (3 unrouted)
N$251  (1 unrouted)
N$252  (1 unrouted)
N$253  (3 unrouted)
N$254  (3 unrouted)
N$255  (1 unrouted)
N$256  (3 unrouted)
N$257  (3 unrouted)
N$258  (3 unrouted)
ON/!OFF_Q1  (4 unrouted)
ON/!OFF_Q2  (4 unrouted)
ON/!OFF_Q3  (4 unrouted)
ON/!OFF_Q4  (4 unrouted)
OPD_PWR  (3 unrouted)
  Bottom 0.5: J6.15 J6.16 53.08,84.31 54.09,83.3 55.14,83.3 56.15,82.29 56.15,81.4 56.79,80.76 R154.1
OPD_SCL  (3 unrouted)
  Bottom 0.3: J6.13 J6.14 54.34,85.91 55.02,85.23 R187.1
OPD_SDA  (3 unrouted)
  Bottom 0.3: J6.12 J6.11 55.61,90.36 56.05,90.8 62.93,90.8 69.49,84.23 69.49,79.02 69.2,78.72 68.2,78.72 68.09,78.83 R167.1
PB6/SCL_Q1  (3 unrouted)
PB6/SCL_Q2  (3 unrouted)
PB6/SCL_Q3  (3 unrouted)
PB6/SCL_Q4  (3 unrouted)
PB7/SDA_Q1  (3 unrouted)
PB7/SDA_Q2  (3 unrouted)
PB7/SDA_Q3  (3 unrouted)
PB7/SDA_Q4  (3 unrouted)
PEN-SCL-FILT_Q1  (6 unrouted)
PEN-SCL-FILT_Q2  (via drill 0.25)  (3 unrouted)
  Top 0.3: v64.3,82.3 61.74,79.74 TP70.1
  Bottom 0.3: R189.2 65.61,80.8 Q25.4 65.44,81.05 65.44,81.58 64.72,82.3 v64.3,82.3 | TP70.1 62.06,78.86 U17.15
PEN-SCL-FILT_Q3  (6 unrouted)
PEN-SCL-FILT_Q4  (6 unrouted)
PEN-SDA-FILT_Q1  (6 unrouted)
PEN-SDA-FILT_Q2  (3 unrouted)
  Bottom 0.3: R185.2 62.35,80.79 62.57,81.01 Q25.6 TP71.1 62.72,78.39 U17.16
PEN-SDA-FILT_Q3  (6 unrouted)
PEN-SDA-FILT_Q4  (6 unrouted)
POUT_Q1  (1 unrouted)
POUT_Q2  (1 unrouted)
POUT_Q3  (1 unrouted)
POUT_Q4  (1 unrouted)
VBUS  (8 unrouted)
  Bottom 1: JP10.3 JP10.4 | JP10.1 JP10.2
  pour Top: 46.1,90.3 46.1,85.42 51.26,80.26 55.02,80.26 55.67,80.91 55.67,82.18 54.98,82.87 52.83,82.87 49.9,85.8 49.9,90 49.6,90.3
VBUSP_Q1  (14 unrouted)
VBUSP_Q2  (14 unrouted)
VBUSP_Q3  (14 unrouted)
VBUSP_Q4  (14 unrouted)
VPD_Q1  (12 unrouted)
VPD_Q2  (via drill 0.25)  (5 unrouted)
  Bottom 0.25: R186.2 58.84,80.71 | R154.2 58.8,79.76 C21.2 59.69,79.72 R168.2
  Bottom 0.3: U20.5 60.56,82.96 60.49,82.89 59.88,82.89 59.62,82.63 59.14,82.63 v59.14,82.59 59.1,82.59 58.74,82.22 58.74,80.81 R186.2 | 58.84,80.71 C21.2 | R154.2 57.78,78.68 TP68.1 | U19.5 68.53,81.54 68.85,81.22 R190.2 | U17.14 61.41,78.3 60.88,78.83 60.88,79.33 60.5,79.72 59.69,79.72
VPD_Q3  (12 unrouted)
VPD_Q4  (12 unrouted)

### Text on the board
tPlace: C2H | OreSat Proto-Card v3.2 | 2019/08/05
Document: X- | Q3 | Q2 | Y+ | Y- | X+ | Q1 | Q4